# Altium project PCB_Concentrator.PrjPcb (part 1 of 3)
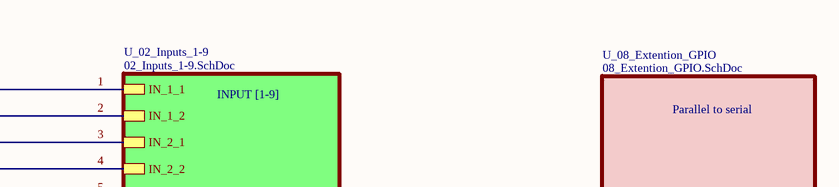
[diagram p0: 01_Main.SchDoc, top left]
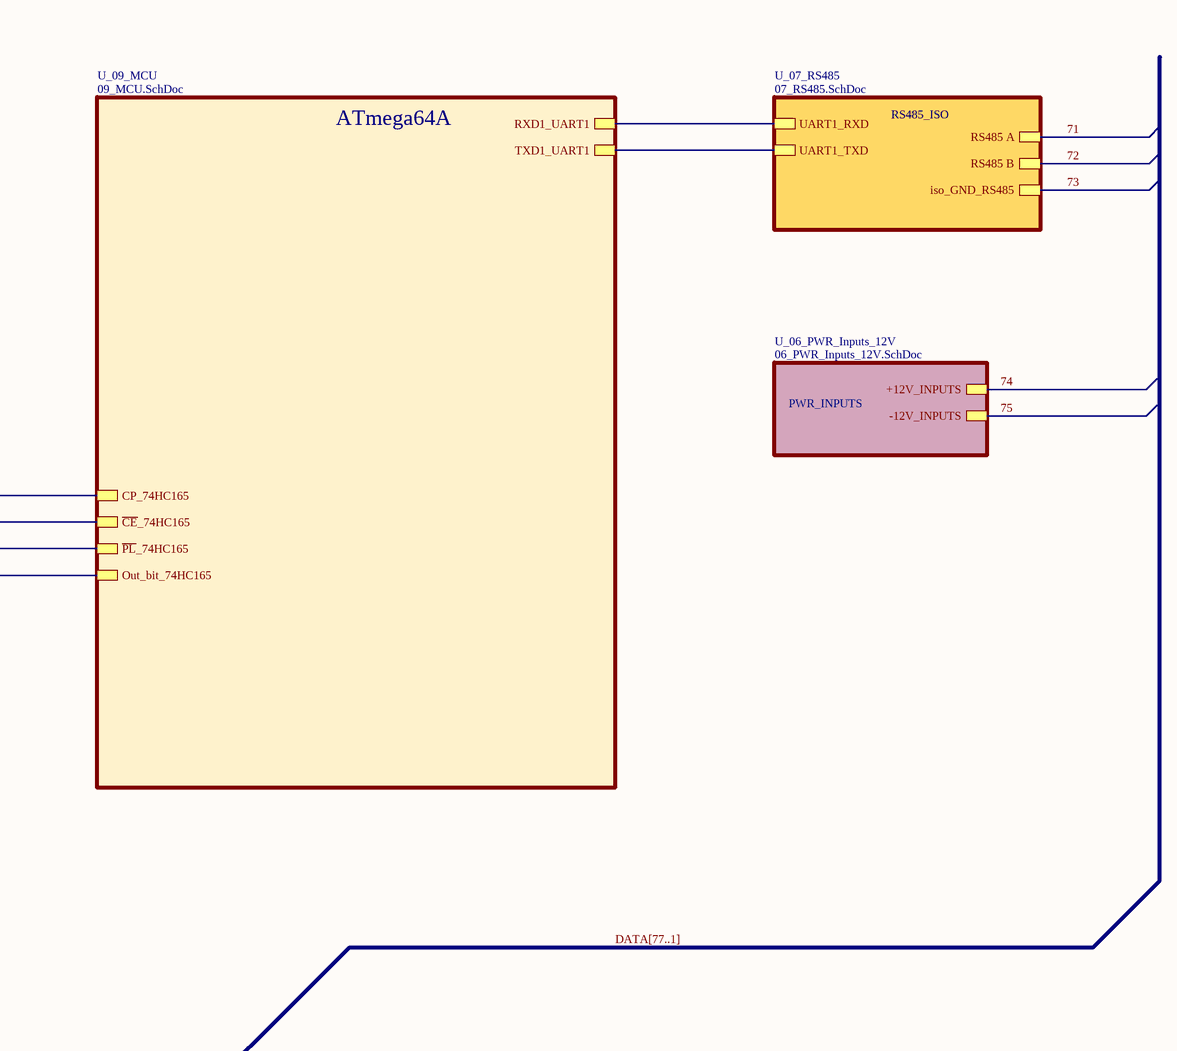
[diagram p1: 01_Main.SchDoc, top right]
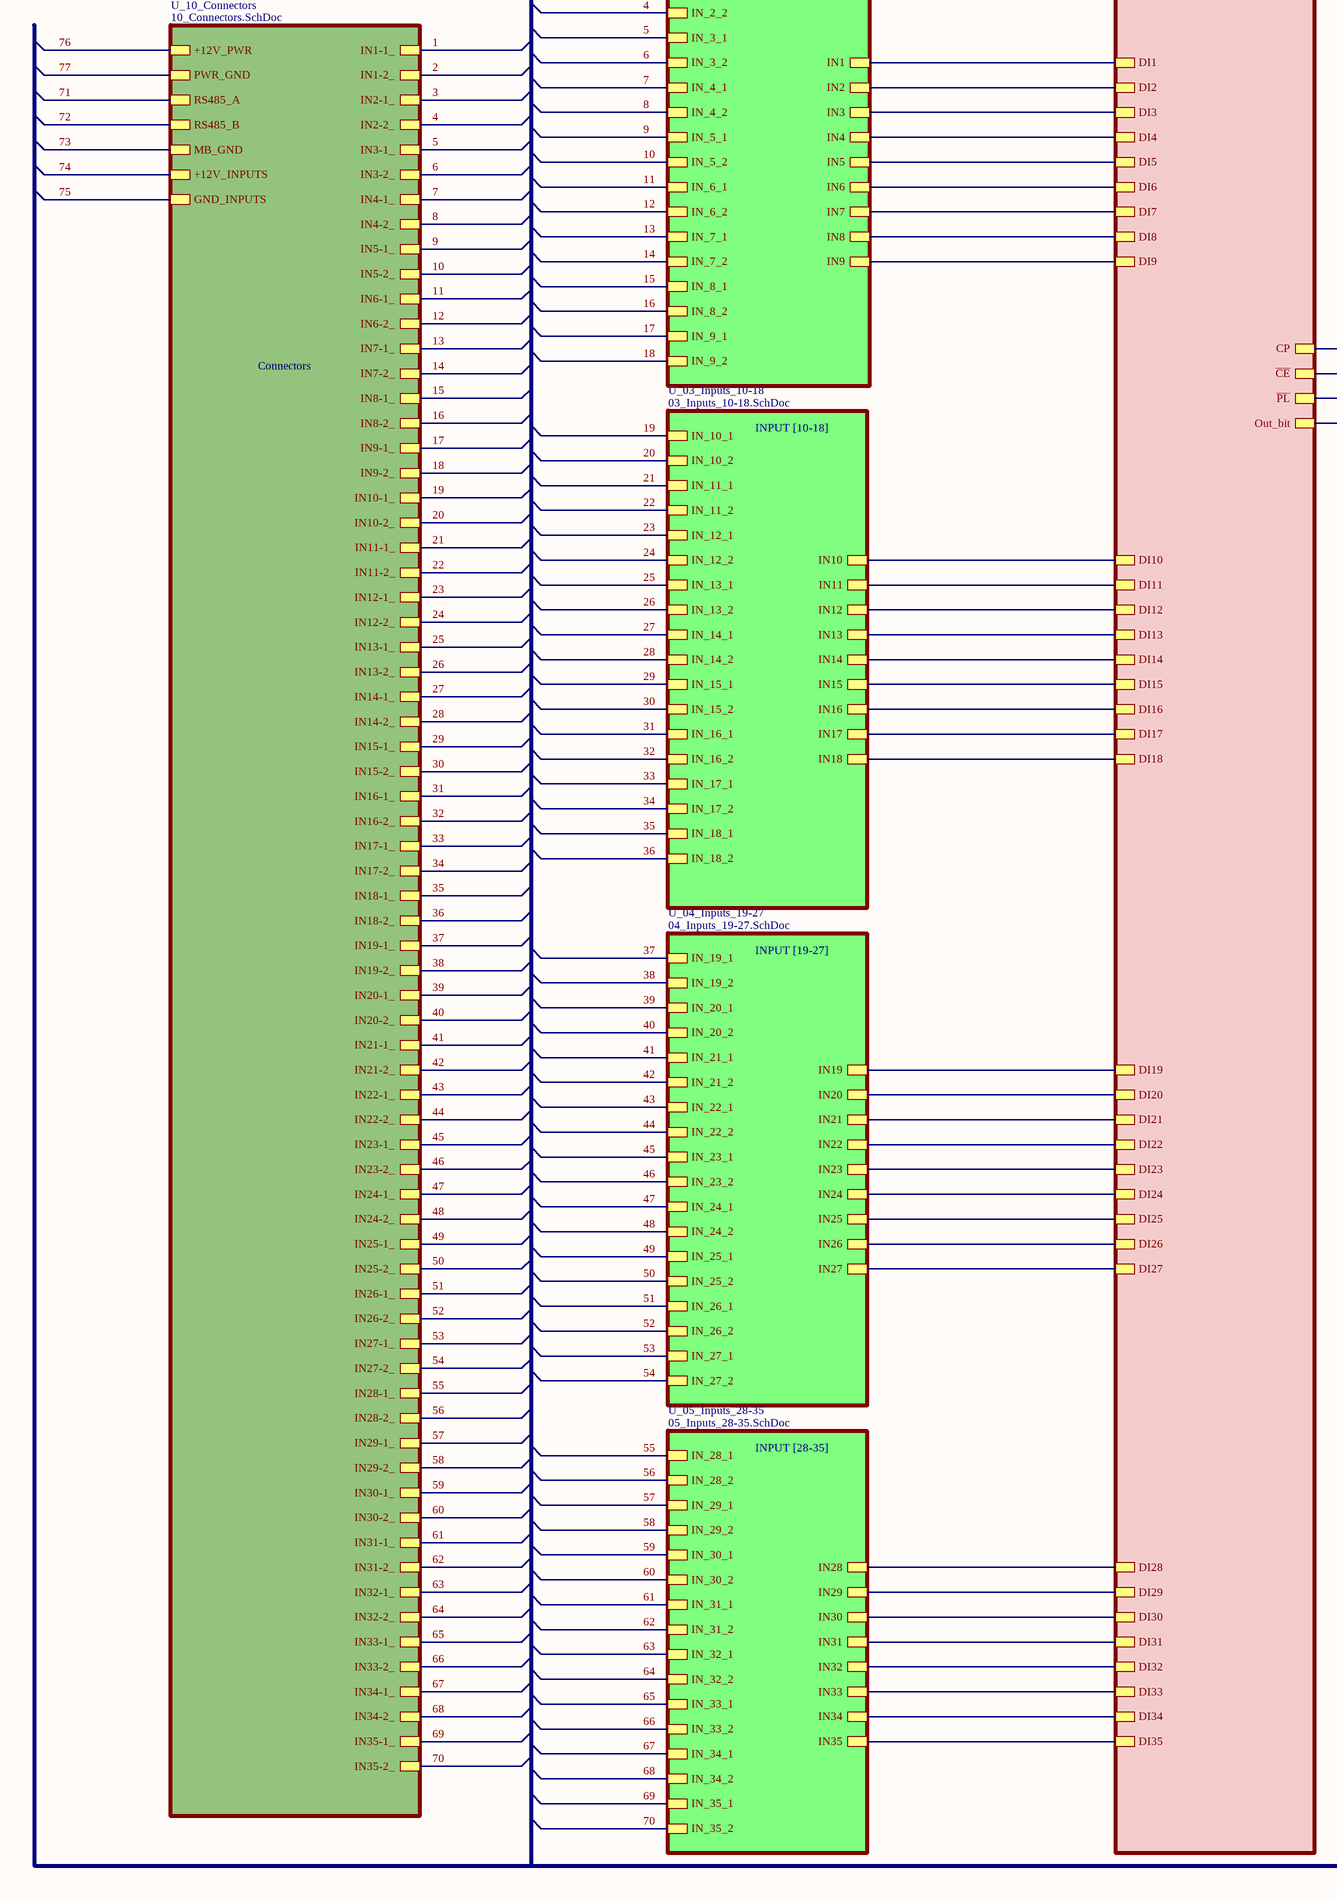
[diagram p2: 01_Main.SchDoc, bottom left]
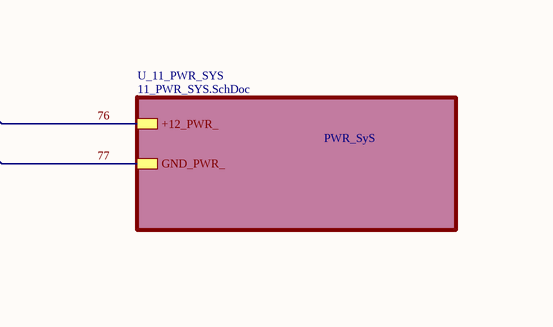
[diagram p3: 01_Main.SchDoc, bottom right]
11 sheets, 542 parts. Net scope: hierarchical (ports join the sheet entries above them; power ports are global).
Board file: pcb-4layer-1oz-1.6mm.PcbDoc
Sheets:
  01_Main.SchDoc
    U_02_Inputs_1-9 = 02_Inputs_1-9.SchDoc
    U_03_Inputs_10-18 = 03_Inputs_10-18.SchDoc
    U_04_Inputs_19-27 = 04_Inputs_19-27.SchDoc
    U_05_Inputs_28-35 = 05_Inputs_28-35.SchDoc
    U_07_RS485 = 07_RS485.SchDoc
    U_06_PWR_Inputs_12V = 06_PWR_Inputs_12V.SchDoc
    U_08_Extention_GPIO = 08_Extention_GPIO.SchDoc
    U_09_MCU = 09_MCU.SchDoc
    U_10_Connectors = 10_Connectors.SchDoc
    U_11_PWR_SYS = 11_PWR_SYS.SchDoc

## Sheet 01_Main.SchDoc: Concentrator
size 594 x 420 mm; ApprovedBy: Ульянов А.В.; CheckedBy: Ульянов А.В.; Author: Ульянов А.В.; CompanyName: voidelectrics; DrawnBy: Ульянов А.В.; Engineer: Ульянов А.В.; Organization: voidelectrics; DocumentNumber: Concentrator; SheetNumber: 1; SheetTotal: 11

### Sub-sheets
U_02_Inputs_1-9 = 02_Inputs_1-9.SchDoc: IN_1_2, IN_1_1, IN_2_2, IN_2_1, IN_3_2, IN_3_1, IN_4_2, IN_4_1, IN_5_2, IN_5_1, IN_6_2, IN_6_1, IN_7_2, IN_7_1, IN_8_2, IN_8_1, IN_9_2, IN_9_1, IN1, IN2, IN3, IN4, IN5, IN6, IN7, IN8, IN9
U_03_Inputs_10-18 = 03_Inputs_10-18.SchDoc: IN_18_2, IN_18_1, IN_10_2, IN_10_1, IN_11_2, IN_11_1, IN_12_2, IN_12_1, IN_13_2, IN_13_1, IN_14_2, IN_14_1, IN_15_2, IN_15_1, IN_16_2, IN_16_1, IN_17_2, IN_17_1, IN18, IN10, IN11, IN12, IN13, IN14, IN15, IN16, IN17
U_04_Inputs_19-27 = 04_Inputs_19-27.SchDoc: IN_19_2, IN_19_1, IN_20_2, IN_20_1, IN_21_2, IN_21_1, IN_22_2, IN_22_1, IN_23_2, IN_23_1, IN_24_2, IN_24_1, IN_25_2, IN_25_1, IN_26_2, IN_26_1, IN_27_2, IN_27_1, IN19, IN20, IN21, IN22, IN23, IN24, IN25, IN26, IN27
U_05_Inputs_28-35 = 05_Inputs_28-35.SchDoc: IN_28_2, IN_28_1, IN_29_2, IN_29_1, IN_30_2, IN_30_1, IN_31_2, IN_31_1, IN_32_2, IN_32_1, IN_33_2, IN_33_1, IN_34_2, IN_34_1, IN_35_2, IN_35_1, IN28, IN29, IN30, IN31, IN32, IN33, IN34, IN35
U_06_PWR_Inputs_12V = 06_PWR_Inputs_12V.SchDoc: +12V_INPUTS, -12V_INPUTS
U_07_RS485 = 07_RS485.SchDoc: UART1_RXD, UART1_TXD, RS485 B, RS485 A, iso_GND_RS485
U_08_Extention_GPIO = 08_Extention_GPIO.SchDoc: DI1, DI2, DI3, DI4, DI5, DI6, DI7, DI8, DI9, DI10, DI11, DI12, DI13, DI14, DI15, DI16, DI17, DI18, DI19, DI20, DI21, DI22, DI23, DI24, DI25, DI26, DI27, DI28, DI29, DI30, DI31, DI32, DI33, DI34, DI35, CP, ~{CE}, ~{PL}, Out_bit
U_09_MCU = 09_MCU.SchDoc: CP_74HC165, ~{CE}_74HC165, ~{PL}_74HC165, Out_bit_74HC165, RXD1_UART1, TXD1_UART1
U_10_Connectors = 10_Connectors.SchDoc: +12V_PWR, PWR_GND, RS485_A, RS485_B, MB_GND, +12V_INPUTS, GND_INPUTS, IN1-1_, IN1-2_, IN2-1_, IN2-2_, IN3-1_, IN3-2_, IN4-1_, IN4-2_, IN5-1_, IN5-2_, IN6-1_, IN6-2_, IN7-1_, IN7-2_, IN8-1_, IN8-2_, IN9-1_, IN9-2_, IN10-1_, IN10-2_, IN11-1_, IN11-2_, IN12-1_, IN12-2_, IN13-1_, IN13-2_, IN14-1_, IN14-2_, IN15-1_, IN15-2_, IN16-1_, IN16-2_, IN17-1_, IN17-2_, IN18-1_, IN18-2_, IN19-1_, IN19-2_, IN20-1_, IN20-2_, IN21-1_, IN21-2_, IN22-1_, IN22-2_, IN23-1_, IN23-2_, IN24-1_, IN24-2_, IN25-1_, IN25-2_, IN26-1_, IN26-2_, IN27-1_, IN27-2_, IN28-1_, IN28-2_, IN29-1_, IN29-2_, IN30-1_, IN30-2_, IN31-1_, IN31-2_, IN32-1_, IN32-2_, IN33-1_, IN33-2_, IN34-1_, IN34-2_, IN35-1_, IN35-2_
U_11_PWR_SYS = 11_PWR_SYS.SchDoc: +12_PWR_, GND_PWR_

### Nets
1: sheet U_02_Inputs_1-9/IN_1_1, sheet U_10_Connectors/IN1-1_
2: sheet U_02_Inputs_1-9/IN_1_2, sheet U_10_Connectors/IN1-2_
3: sheet U_02_Inputs_1-9/IN_2_1, sheet U_10_Connectors/IN2-1_
4: sheet U_02_Inputs_1-9/IN_2_2, sheet U_10_Connectors/IN2-2_
5: sheet U_02_Inputs_1-9/IN_3_1, sheet U_10_Connectors/IN3-1_
6: sheet U_02_Inputs_1-9/IN_3_2, sheet U_10_Connectors/IN3-2_
7: sheet U_02_Inputs_1-9/IN_4_1, sheet U_10_Connectors/IN4-1_
8: sheet U_02_Inputs_1-9/IN_4_2, sheet U_10_Connectors/IN4-2_
9: sheet U_02_Inputs_1-9/IN_5_1, sheet U_10_Connectors/IN5-1_
10: sheet U_02_Inputs_1-9/IN_5_2, sheet U_10_Connectors/IN5-2_
11: sheet U_02_Inputs_1-9/IN_6_1, sheet U_10_Connectors/IN6-1_
12: sheet U_02_Inputs_1-9/IN_6_2, sheet U_10_Connectors/IN6-2_
13: sheet U_02_Inputs_1-9/IN_7_1, sheet U_10_Connectors/IN7-1_
14: sheet U_02_Inputs_1-9/IN_7_2, sheet U_10_Connectors/IN7-2_
15: sheet U_02_Inputs_1-9/IN_8_1, sheet U_10_Connectors/IN8-1_
16: sheet U_02_Inputs_1-9/IN_8_2, sheet U_10_Connectors/IN8-2_
17: sheet U_02_Inputs_1-9/IN_9_1, sheet U_10_Connectors/IN9-1_
18: sheet U_02_Inputs_1-9/IN_9_2, sheet U_10_Connectors/IN9-2_
19: sheet U_03_Inputs_10-18/IN_10_1, sheet U_10_Connectors/IN10-1_
20: sheet U_03_Inputs_10-18/IN_10_2, sheet U_10_Connectors/IN10-2_
21: sheet U_03_Inputs_10-18/IN_11_1, sheet U_10_Connectors/IN11-1_
22: sheet U_03_Inputs_10-18/IN_11_2, sheet U_10_Connectors/IN11-2_
23: sheet U_03_Inputs_10-18/IN_12_1, sheet U_10_Connectors/IN12-1_
24: sheet U_03_Inputs_10-18/IN_12_2, sheet U_10_Connectors/IN12-2_
25: sheet U_03_Inputs_10-18/IN_13_1, sheet U_10_Connectors/IN13-1_
26: sheet U_03_Inputs_10-18/IN_13_2, sheet U_10_Connectors/IN13-2_
27: sheet U_03_Inputs_10-18/IN_14_1, sheet U_10_Connectors/IN14-1_
28: sheet U_03_Inputs_10-18/IN_14_2, sheet U_10_Connectors/IN14-2_
29: sheet U_03_Inputs_10-18/IN_15_1, sheet U_10_Connectors/IN15-1_
30: sheet U_03_Inputs_10-18/IN_15_2, sheet U_10_Connectors/IN15-2_
31: sheet U_03_Inputs_10-18/IN_16_1, sheet U_10_Connectors/IN16-1_
32: sheet U_03_Inputs_10-18/IN_16_2, sheet U_10_Connectors/IN16-2_
33: sheet U_03_Inputs_10-18/IN_17_1, sheet U_10_Connectors/IN17-1_
34: sheet U_03_Inputs_10-18/IN_17_2, sheet U_10_Connectors/IN17-2_
35: sheet U_03_Inputs_10-18/IN_18_1, sheet U_10_Connectors/IN18-1_
36: sheet U_03_Inputs_10-18/IN_18_2, sheet U_10_Connectors/IN18-2_
37: sheet U_04_Inputs_19-27/IN_19_1, sheet U_10_Connectors/IN19-1_
38: sheet U_04_Inputs_19-27/IN_19_2, sheet U_10_Connectors/IN19-2_
39: sheet U_04_Inputs_19-27/IN_20_1, sheet U_10_Connectors/IN20-1_
40: sheet U_04_Inputs_19-27/IN_20_2, sheet U_10_Connectors/IN20-2_
41: sheet U_04_Inputs_19-27/IN_21_1, sheet U_10_Connectors/IN21-1_
42: sheet U_04_Inputs_19-27/IN_21_2, sheet U_10_Connectors/IN21-2_
43: sheet U_04_Inputs_19-27/IN_22_1, sheet U_10_Connectors/IN22-1_
44: sheet U_04_Inputs_19-27/IN_22_2, sheet U_10_Connectors/IN22-2_
45: sheet U_04_Inputs_19-27/IN_23_1, sheet U_10_Connectors/IN23-1_
46: sheet U_04_Inputs_19-27/IN_23_2, sheet U_10_Connectors/IN23-2_
47: sheet U_04_Inputs_19-27/IN_24_1, sheet U_10_Connectors/IN24-1_
48: sheet U_04_Inputs_19-27/IN_24_2, sheet U_10_Connectors/IN24-2_
49: sheet U_04_Inputs_19-27/IN_25_1, sheet U_10_Connectors/IN25-1_
50: sheet U_04_Inputs_19-27/IN_25_2, sheet U_10_Connectors/IN25-2_
51: sheet U_04_Inputs_19-27/IN_26_1, sheet U_10_Connectors/IN26-1_
52: sheet U_04_Inputs_19-27/IN_26_2, sheet U_10_Connectors/IN26-2_
53: sheet U_04_Inputs_19-27/IN_27_1, sheet U_10_Connectors/IN27-1_
54: sheet U_04_Inputs_19-27/IN_27_2, sheet U_10_Connectors/IN27-2_
55: sheet U_05_Inputs_28-35/IN_28_1, sheet U_10_Connectors/IN28-1_
56: sheet U_05_Inputs_28-35/IN_28_2, sheet U_10_Connectors/IN28-2_
57: sheet U_05_Inputs_28-35/IN_29_1, sheet U_10_Connectors/IN29-1_
58: sheet U_05_Inputs_28-35/IN_29_2, sheet U_10_Connectors/IN29-2_
59: sheet U_05_Inputs_28-35/IN_30_1, sheet U_10_Connectors/IN30-1_
60: sheet U_05_Inputs_28-35/IN_30_2, sheet U_10_Connectors/IN30-2_
61: sheet U_05_Inputs_28-35/IN_31_1, sheet U_10_Connectors/IN31-1_
62: sheet U_05_Inputs_28-35/IN_31_2, sheet U_10_Connectors/IN31-2_
63: sheet U_05_Inputs_28-35/IN_32_1, sheet U_10_Connectors/IN32-1_
64: sheet U_05_Inputs_28-35/IN_32_2, sheet U_10_Connectors/IN32-2_
65: sheet U_05_Inputs_28-35/IN_33_1, sheet U_10_Connectors/IN33-1_
66: sheet U_05_Inputs_28-35/IN_33_2, sheet U_10_Connectors/IN33-2_
67: sheet U_05_Inputs_28-35/IN_34_1, sheet U_10_Connectors/IN34-1_
68: sheet U_05_Inputs_28-35/IN_34_2, sheet U_10_Connectors/IN34-2_
69: sheet U_05_Inputs_28-35/IN_35_1, sheet U_10_Connectors/IN35-1_
70: sheet U_05_Inputs_28-35/IN_35_2, sheet U_10_Connectors/IN35-2_
71: sheet U_07_RS485/RS485 A, sheet U_10_Connectors/RS485_A
72: sheet U_07_RS485/RS485 B, sheet U_10_Connectors/RS485_B
73: sheet U_07_RS485/iso_GND_RS485, sheet U_10_Connectors/MB_GND
74: sheet U_06_PWR_Inputs_12V/+12V_INPUTS, sheet U_10_Connectors/+12V_INPUTS
75: sheet U_06_PWR_Inputs_12V/-12V_INPUTS, sheet U_10_Connectors/GND_INPUTS
76: sheet U_10_Connectors/+12V_PWR, sheet U_11_PWR_SYS/+12_PWR_
77: sheet U_10_Connectors/PWR_GND, sheet U_11_PWR_SYS/GND_PWR_
RXD: sheet U_07_RS485/UART1_RXD, sheet U_09_MCU/RXD1_UART1
TXD: sheet U_07_RS485/UART1_TXD, sheet U_09_MCU/TXD1_UART1
NetR15_2: sheet U_05_Inputs_28-35/IN31, sheet U_08_Extention_GPIO/DI31
NetR16_2: sheet U_05_Inputs_28-35/IN28, sheet U_08_Extention_GPIO/DI28
NetR20_2: sheet U_05_Inputs_28-35/IN34, sheet U_08_Extention_GPIO/DI34
NetR31_2: sheet U_05_Inputs_28-35/IN29, sheet U_08_Extention_GPIO/DI29
NetR32_2: sheet U_05_Inputs_28-35/IN32, sheet U_08_Extention_GPIO/DI32
NetR40_2: sheet U_05_Inputs_28-35/IN35, sheet U_08_Extention_GPIO/DI35
NetR47_2: sheet U_05_Inputs_28-35/IN33, sheet U_08_Extention_GPIO/DI33
NetR48_2: sheet U_05_Inputs_28-35/IN30, sheet U_08_Extention_GPIO/DI30
NetR64_2: sheet U_02_Inputs_1-9/IN1, sheet U_08_Extention_GPIO/DI1
NetR65_2: sheet U_02_Inputs_1-9/IN4, sheet U_08_Extention_GPIO/DI4
NetR66_2: sheet U_02_Inputs_1-9/IN7, sheet U_08_Extention_GPIO/DI7
NetR82_2: sheet U_02_Inputs_1-9/IN2, sheet U_08_Extention_GPIO/DI2
NetR83_2: sheet U_02_Inputs_1-9/IN5, sheet U_08_Extention_GPIO/DI5
NetR84_2: sheet U_02_Inputs_1-9/IN8, sheet U_08_Extention_GPIO/DI8
NetR100_2: sheet U_02_Inputs_1-9/IN6, sheet U_08_Extention_GPIO/DI6
NetR101_2: sheet U_02_Inputs_1-9/IN9, sheet U_08_Extention_GPIO/DI9
NetR102_2: sheet U_02_Inputs_1-9/IN3, sheet U_08_Extention_GPIO/DI3
NetR118_2: sheet U_03_Inputs_10-18/IN18, sheet U_08_Extention_GPIO/DI18
NetR119_2: sheet U_03_Inputs_10-18/IN12, sheet U_08_Extention_GPIO/DI12
NetR120_2: sheet U_03_Inputs_10-18/IN15, sheet U_08_Extention_GPIO/DI15
NetR136_2: sheet U_03_Inputs_10-18/IN10, sheet U_08_Extention_GPIO/DI10
NetR137_2: sheet U_03_Inputs_10-18/IN13, sheet U_08_Extention_GPIO/DI13
NetR138_2: sheet U_03_Inputs_10-18/IN16, sheet U_08_Extention_GPIO/DI16
NetR154_2: sheet U_03_Inputs_10-18/IN11, sheet U_08_Extention_GPIO/DI11
NetR155_2: sheet U_03_Inputs_10-18/IN14, sheet U_08_Extention_GPIO/DI14
NetR156_2: sheet U_03_Inputs_10-18/IN17, sheet U_08_Extention_GPIO/DI17
NetR172_2: sheet U_04_Inputs_19-27/IN22, sheet U_08_Extention_GPIO/DI22
NetR173_2: sheet U_04_Inputs_19-27/IN19, sheet U_08_Extention_GPIO/DI19
NetR174_2: sheet U_04_Inputs_19-27/IN25, sheet U_08_Extention_GPIO/DI25
NetR190_2: sheet U_04_Inputs_19-27/IN20, sheet U_08_Extention_GPIO/DI20
NetR191_2: sheet U_04_Inputs_19-27/IN23, sheet U_08_Extention_GPIO/DI23
NetR192_2: sheet U_04_Inputs_19-27/IN26, sheet U_08_Extention_GPIO/DI26
NetR208_2: sheet U_04_Inputs_19-27/IN21, sheet U_08_Extention_GPIO/DI21
NetR209_2: sheet U_04_Inputs_19-27/IN24, sheet U_08_Extention_GPIO/DI24
NetR210_2: sheet U_04_Inputs_19-27/IN27, sheet U_08_Extention_GPIO/DI27
NetR220_1: sheet U_08_Extention_GPIO/Out_bit, sheet U_09_MCU/Out_bit_74HC165
NetR221_1: sheet U_08_Extention_GPIO/CP, sheet U_09_MCU/CP_74HC165
NetR222_1: sheet U_08_Extention_GPIO/~{PL}, sheet U_09_MCU/~{PL}_74HC165
NetR228_1: sheet U_08_Extention_GPIO/~{CE}, sheet U_09_MCU/~{CE}_74HC165

### Buses and harness runs
bus DATA[77..1]

### Notes on the sheet
- INPUT [1-9]
- Parallel to serial
- ATmega64A
- RS485_ISO
- PWR_INPUTS
- Connectors
- INPUT [10-18]
- INPUT [19-27]
- PWR_SyS
- INPUT [28-35]
- Перв. примен.
- Справ. №
- Подп. и дата
- Инв. № дубл.
- Взам. инв. №
- Разраб.
- Изм.
- Лист
- № докум.
- Подп.
- Дата
- Лит.
- Масса
- Масштаб
- Пров.
- Т.контр.
- Листов
- Инв. № подл.
- Утв.
- Н.контр.
- 2.106-A2
- Копировал
- Формат А2

## Sheet 02_Inputs_1-9.SchDoc
size 594 x 420 mm; DocumentNumber: Входы сухой контакт; SheetNumber: 2; SheetTotal: 7
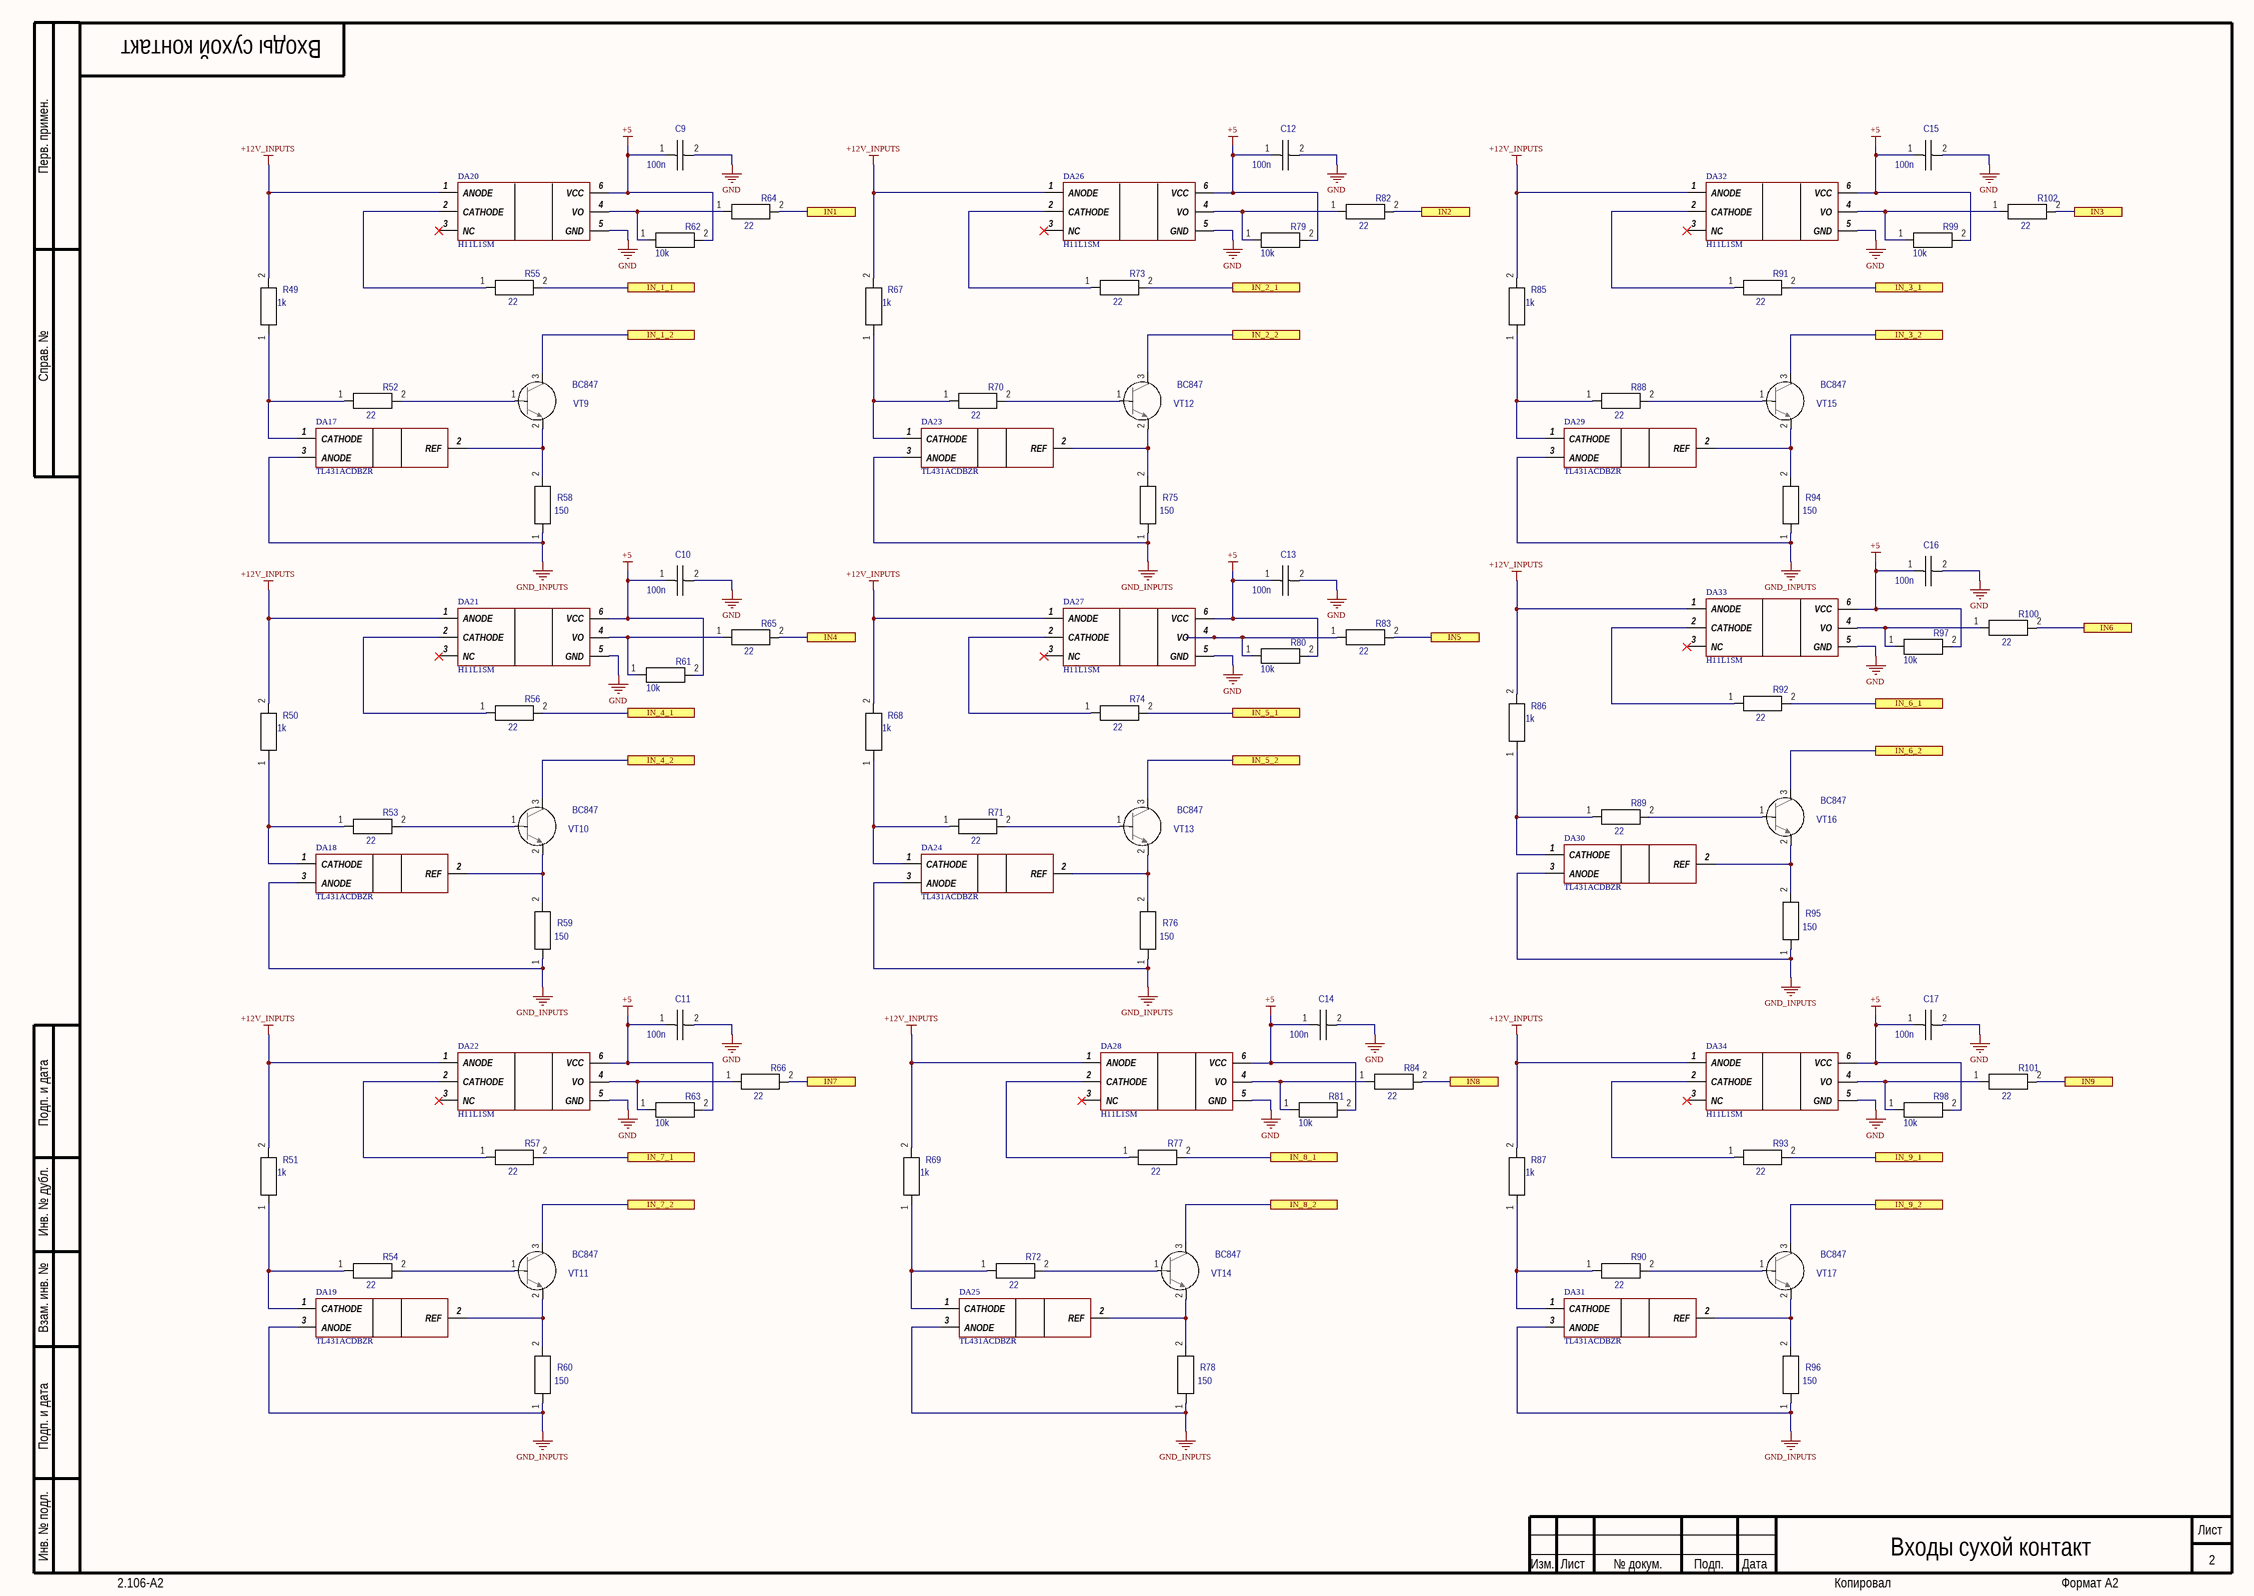
[diagram p4: 02_Inputs_1-9.SchDoc]

### Parts
C9  value 100n  [C0603]  (hidden comment: C0603)
C10  value 100n  [C0603]  (hidden comment: C0603)
C11  value 100n  [C0603]  (hidden comment: C0603)
C12  value 100n  [C0603]  (hidden comment: C0603)
C13  value 100n  [C0603]  (hidden comment: C0603)
C14  value 100n  [C0603]  (hidden comment: C0603)
C15  value 100n  [C0603]  (hidden comment: C0603)
C16  value 100n  [C0603]  (hidden comment: C0603)
C17  value 100n  [C0603]  (hidden comment: C0603)
DA17  TL431ACDBZR  [SOT95P237X112-3N]
DA18  TL431ACDBZR  [SOT95P237X112-3N]
DA19  TL431ACDBZR  [SOT95P237X112-3N]
DA20  H11L1SM  [SOP254P1030X460-6N]
DA21  H11L1SM  [SOP254P1030X460-6N]
DA22  H11L1SM  [SOP254P1030X460-6N]
DA23  TL431ACDBZR  [SOT95P237X112-3N]
DA24  TL431ACDBZR  [SOT95P237X112-3N]
DA25  TL431ACDBZR  [SOT95P237X112-3N]
DA26  H11L1SM  [SOP254P1030X460-6N]
DA27  H11L1SM  [SOP254P1030X460-6N]
DA28  H11L1SM  [SOP254P1030X460-6N]
DA29  TL431ACDBZR  [SOT95P237X112-3N]
DA30  TL431ACDBZR  [SOT95P237X112-3N]
DA31  TL431ACDBZR  [SOT95P237X112-3N]
DA32  H11L1SM  [SOP254P1030X460-6N]
DA33  H11L1SM  [SOP254P1030X460-6N]
DA34  H11L1SM  [SOP254P1030X460-6N]
R49  value 1k  [RESC1608N]  (hidden comment: R0603)
R50  value 1k  [RESC1608N]  (hidden comment: R0603)
R51  value 1k  [RESC1608N]  (hidden comment: R0603)
R52  value 22  [RESC1608N]  (hidden comment: R0603)
R53  value 22  [RESC1608N]  (hidden comment: R0603)
R54  value 22  [RESC1608N]  (hidden comment: R0603)
R55  value 22  [RESC1608N]  (hidden comment: R0603)
R56  value 22  [RESC1608N]  (hidden comment: R0603)
R57  value 22  [RESC1608N]  (hidden comment: R0603)
R58  value 150  [RESC1608N]  (hidden comment: R0603)
R59  value 150  [RESC1608N]  (hidden comment: R0603)
R60  value 150  [RESC1608N]  (hidden comment: R0603)
R61  value 10k  [RESC1608N]  (hidden comment: R0603)
R62  value 10k  [RESC1608N]  (hidden comment: R0603)
R63  value 10k  [RESC1608N]  (hidden comment: R0603)
R64  value 22  [RESC1608N]  (hidden comment: R0603)
R65  value 22  [RESC1608N]  (hidden comment: R0603)
R66  value 22  [RESC1608N]  (hidden comment: R0603)
R67  value 1k  [RESC1608N]  (hidden comment: R0603)
R68  value 1k  [RESC1608N]  (hidden comment: R0603)
R69  value 1k  [RESC1608N]  (hidden comment: R0603)
R70  value 22  [RESC1608N]  (hidden comment: R0603)
R71  value 22  [RESC1608N]  (hidden comment: R0603)
R72  value 22  [RESC1608N]  (hidden comment: R0603)
R73  value 22  [RESC1608N]  (hidden comment: R0603)
R74  value 22  [RESC1608N]  (hidden comment: R0603)
R75  value 150  [RESC1608N]  (hidden comment: R0603)
R76  value 150  [RESC1608N]  (hidden comment: R0603)
R77  value 22  [RESC1608N]  (hidden comment: R0603)
R78  value 150  [RESC1608N]  (hidden comment: R0603)
R79  value 10k  [RESC1608N]  (hidden comment: R0603)
R80  value 10k  [RESC1608N]  (hidden comment: R0603)
R81  value 10k  [RESC1608N]  (hidden comment: R0603)
R82  value 22  [RESC1608N]  (hidden comment: R0603)
R83  value 22  [RESC1608N]  (hidden comment: R0603)
R84  value 22  [RESC1608N]  (hidden comment: R0603)
R85  value 1k  [RESC1608N]  (hidden comment: R0603)
R86  value 1k  [RESC1608N]  (hidden comment: R0603)
R87  value 1k  [RESC1608N]  (hidden comment: R0603)
R88  value 22  [RESC1608N]  (hidden comment: R0603)
R89  value 22  [RESC1608N]  (hidden comment: R0603)
R90  value 22  [RESC1608N]  (hidden comment: R0603)
R91  value 22  [RESC1608N]  (hidden comment: R0603)
R92  value 22  [RESC1608N]  (hidden comment: R0603)
R93  value 22  [RESC1608N]  (hidden comment: R0603)
R94  value 150  [RESC1608N]  (hidden comment: R0603)
R95  value 150  [RESC1608N]  (hidden comment: R0603)
R96  value 150  [RESC1608N]  (hidden comment: R0603)
R97  value 10k  [RESC1608N]  (hidden comment: R0603)
R98  value 10k  [RESC1608N]  (hidden comment: R0603)
R99  value 10k  [RESC1608N]  (hidden comment: R0603)
R100  value 22  [RESC1608N]  (hidden comment: R0603)
R101  value 22  [RESC1608N]  (hidden comment: R0603)
R102  value 22  [RESC1608N]  (hidden comment: R0603)
VT9  BC847  [SOT23-3N]
VT10  BC847  [SOT23-3N]
VT11  BC847  [SOT23-3N]
VT12  BC847  [SOT23-3N]
VT13  BC847  [SOT23-3N]
VT14  BC847  [SOT23-3N]
VT15  BC847  [SOT23-3N]
VT16  BC847  [SOT23-3N]
VT17  BC847  [SOT23-3N]

### Ports
IN1, IN2, IN3, IN4, IN5, IN6, IN7, IN8, IN9, IN_1_1, IN_1_2, IN_2_1, IN_2_2, IN_3_1, IN_3_2, IN_4_1, IN_4_2, IN_5_1, IN_5_2, IN_6_1, IN_6_2, IN_7_1, IN_7_2, IN_8_1, IN_8_2, IN_9_1, IN_9_2

### Nets
+5: C9.1 C10.1 C11.1 C12.1 C13.1 C14.1 C15.1 C16.1 C17.1 DA20.6(VCC) DA21.6(VCC) DA22.6(VCC) DA26.6(VCC) DA27.6(VCC) DA28.6(VCC) DA32.6(VCC) DA33.6(VCC) DA34.6(VCC) R61.2 R62.2 R63.2 R79.2 R80.2 R81.2 R97.2 R98.2 R99.2
+12V_INPUTS: DA20.1(ANODE) DA21.1(ANODE) DA22.1(ANODE) DA26.1(ANODE) DA27.1(ANODE) DA28.1(ANODE) DA32.1(ANODE) DA33.1(ANODE) DA34.1(ANODE) R49.2 R50.2 R51.2 R67.2 R68.2 R69.2 R85.2 R86.2 R87.2
GND: C9.2 C10.2 C11.2 C12.2 C13.2 C14.2 C15.2 C16.2 C17.2 DA20.5(GND) DA21.5(GND) DA22.5(GND) DA26.5(GND) DA27.5(GND) DA28.5(GND) DA32.5(GND) DA33.5(GND) DA34.5(GND)
GND_INPUTS: DA17.3(ANODE) DA18.3(ANODE) DA19.3(ANODE) DA23.3(ANODE) DA24.3(ANODE) DA25.3(ANODE) DA29.3(ANODE) DA30.3(ANODE) DA31.3(ANODE) R58.1 R59.1 R60.1 R75.1 R76.1 R78.1 R94.1 R95.1 R96.1
1: R55.2 ; port IN_1_1
2: VT9.3 ; port IN_1_2
3: R73.2 ; port IN_2_1
4: VT12.3 ; port IN_2_2
5: R91.2 ; port IN_3_1
6: VT15.3 ; port IN_3_2
7: R56.2 ; port IN_4_1
8: VT10.3 ; port IN_4_2
9: R74.2 ; port IN_5_1
10: VT13.3 ; port IN_5_2
11: R92.2 ; port IN_6_1
12: VT16.3 ; port IN_6_2
13: R57.2 ; port IN_7_1
14: VT11.3 ; port IN_7_2
15: R77.2 ; port IN_8_1
16: VT14.3 ; port IN_8_2
17: R93.2 ; port IN_9_1
18: VT17.3 ; port IN_9_2
NetDA17_1: DA17.1(CATHODE) R49.1 R52.1
NetDA17_2: DA17.2(REF) R58.2 VT9.2
NetDA18_1: DA18.1(CATHODE) R50.1 R53.1
NetDA18_2: DA18.2(REF) R59.2 VT10.2
NetDA19_1: DA19.1(CATHODE) R51.1 R54.1
NetDA19_2: DA19.2(REF) R60.2 VT11.2
NetDA20_2: DA20.2(CATHODE) R55.1
NetDA20_4: DA20.4(VO) R62.1 R64.1
NetDA21_2: DA21.2(CATHODE) R56.1
NetDA21_4: DA21.4(VO) R61.1 R65.1
NetDA22_2: DA22.2(CATHODE) R57.1
NetDA22_4: DA22.4(VO) R63.1 R66.1
NetDA23_1: DA23.1(CATHODE) R67.1 R70.1
NetDA23_2: DA23.2(REF) R75.2 VT12.2
NetDA24_1: DA24.1(CATHODE) R68.1 R71.1
NetDA24_2: DA24.2(REF) R76.2 VT13.2
NetDA25_1: DA25.1(CATHODE) R69.1 R72.1
NetDA25_2: DA25.2(REF) R78.2 VT14.2
NetDA26_2: DA26.2(CATHODE) R73.1
NetDA26_4: DA26.4(VO) R79.1 R82.1
NetDA27_2: DA27.2(CATHODE) R74.1
NetDA27_4: DA27.4(VO) R80.1 R83.1
NetDA28_2: DA28.2(CATHODE) R77.1
NetDA28_4: DA28.4(VO) R81.1 R84.1
NetDA29_1: DA29.1(CATHODE) R85.1 R88.1
NetDA29_2: DA29.2(REF) R94.2 VT15.2
NetDA30_1: DA30.1(CATHODE) R86.1 R89.1
NetDA30_2: DA30.2(REF) R95.2 VT16.2
NetDA31_1: DA31.1(CATHODE) R87.1 R90.1
NetDA31_2: DA31.2(REF) R96.2 VT17.2
NetDA32_2: DA32.2(CATHODE) R91.1
NetDA32_4: DA32.4(VO) R99.1 R102.1
NetDA33_2: DA33.2(CATHODE) R92.1
NetDA33_4: DA33.4(VO) R97.1 R100.1
NetDA34_2: DA34.2(CATHODE) R93.1
NetDA34_4: DA34.4(VO) R98.1 R101.1
NetR52_2: R52.2 VT9.1
NetR53_2: R53.2 VT10.1
NetR54_2: R54.2 VT11.1
NetR64_2: R64.2 ; port IN1
NetR65_2: R65.2 ; port IN4
NetR66_2: R66.2 ; port IN7
NetR70_2: R70.2 VT12.1
NetR71_2: R71.2 VT13.1
NetR72_2: R72.2 VT14.1
NetR82_2: R82.2 ; port IN2
NetR83_2: R83.2 ; port IN5
NetR84_2: R84.2 ; port IN8
NetR88_2: R88.2 VT15.1
NetR89_2: R89.2 VT16.1
NetR90_2: R90.2 VT17.1
NetR100_2: R100.2 ; port IN6
NetR101_2: R101.2 ; port IN9
NetR102_2: R102.2 ; port IN3

Not connected (* = marked no-connect by the designer): DA20 3(NC)*; DA21 3(NC)*; DA22 3(NC)*; DA26 3(NC)*; DA27 3(NC)*; DA28 3(NC)*; DA32 3(NC)*; DA33 3(NC)*; DA34 3(NC)*

### Notes on the sheet
- Перв. примен.
- Справ. №
- Подп. и дата
- Инв. № дубл.
- Взам. инв. №
- Инв. № подл.
- Изм.
- Лист
- № докум.
- Подп.
- Дата
- 2.106-A2
- Копировал
- Формат А2

### Library data of the parts
C9-C17 = GRM188R71C104KA01D: Manufacturer: Murata Manufacturing; Код: 22; ID: Конденсатор; Power/Voltage: 16V; Tolerance: ±10%; TKE: X7R; iii: Конденсатор GRM188R71C104KA01D 100n 16V ±10% C0603 X7R  Murata Manufacturing; Comments: C0603; Part Number: GRM188R71C104KA01D; Height: 0.9; Package: C0603; TemperatureMin: -55; TemperatureMax: 125
DA17-DA19 DA23-DA25 DA29-DA31 = TL431ACDBZR: Integrated Circuit; Manufacturer_Name: Texas Instruments; Datasheet Link: https://datasheet.datasheetarchive.com/originals/distributors/SFDatasheet-6/sf-000131849.pdf; Manufacturer_Part_Number: TL431ACDBZR; Mouser Part Number: 595-TL431ACDBZR; Mouser Price/Stock: https://www.mouser.co.uk/ProductDetail/Texas-Instruments/TL431ACDBZR?qs=odmYgEirbwzMcBuFx%2Fo8hQ%3D%3D; Arrow Part Number: TL431ACDBZR; Arrow Price/Stock: https://www.arrow.com/en/products/tl431acdbzr/texas-instruments?region=nac; PartNumber: TL431ACDBZR
DA20-DA22 DA26-DA28 DA32-DA34 = H11L1SM: Integrated Circuit; Manufacturer_Name: Iso Com; Datasheet Link: http://isocom.com/wp-content/uploads/2017/09/DD93224-H11L1_H11L1V-110817.pdf; Height: 4.6mm; Manufacturer_Part_Number: H11L1SM; PartNumber: H11L1SM
R49-R51 R67-R69 R85-R87 = RC0603FK-071KL: Manufacturer: Тайвань; Код: 31; ID: Резистор; Power/Voltage: 0.063W/50V; Tolerance: ±1%; iii: Резистор RC0603FK-071KL 1k 0.063W/50V ±1% R0603  Тайвань; Comments: R0603; Part Number: RC0603FK-071KL; Package: R0603; TemperatureMin: -55; TemperatureMax: 155
R52-R57 R64-R66 R70-R74 R77 R82-R84 R88-R93 R100-R102 = RC0603FK-0722RL: Manufacturer: Тайвань; Код: 11; ID: Резистор; Power/Voltage: 0.063W/50V; Tolerance: ±1%; iii: Резистор RC0603FK-0722RL 22 0.063W/50V ±1% R0603  Тайвань; Comments: R0603; Part Number: RC0603FK-0722RL; Package: R0603; TemperatureMin: -55; TemperatureMax: 155
R58-R60 R75 R76 R78 R94-R96 = RC0603FK-07150RL: Manufacturer: Тайвань; Код: 17; ID: Резистор; Power/Voltage: 0.063W/50V; Tolerance: ±1%; iii: Резистор RC0603FK-07150RL 150 0.063W/50V ±1% R0603  Тайвань; Comments: R0603; Part Number: RC0603FK-07150RL; Package: R0603; TemperatureMin: -55; TemperatureMax: 155
R61-R63 R79-R81 R97-R99 = RC0603FK-0710KL: Part Number: RC0603FR-0710KL; Manufacturer: Тайвань; Код: 26; ID: Резистор; Power/Voltage: 0.063W/50V; Tolerance: ±1%; iii: Резистор RC0603FK-0710KL 10k 0.063W/50V ±1% R0603  Тайвань; Comments: R0603; Package: R0603; TemperatureMin: -55; TemperatureMax: 155
VT9-VT17 = BC847: Manufacturer: NXP Semiconductor; Код: 2; ID: Транзистор; Value: 0.1A; Power/Voltage: 45V; iii: Транзистор BC847 0.1A 45V  sot23  NXP Semiconductor; Com: BC847; Part Number: BC847; Package: sot23

## Sheet 03_Inputs_10-18.SchDoc
size 594 x 420 mm; DocumentNumber: Входы сухой контакт; SheetNumber: 3; SheetTotal: 6
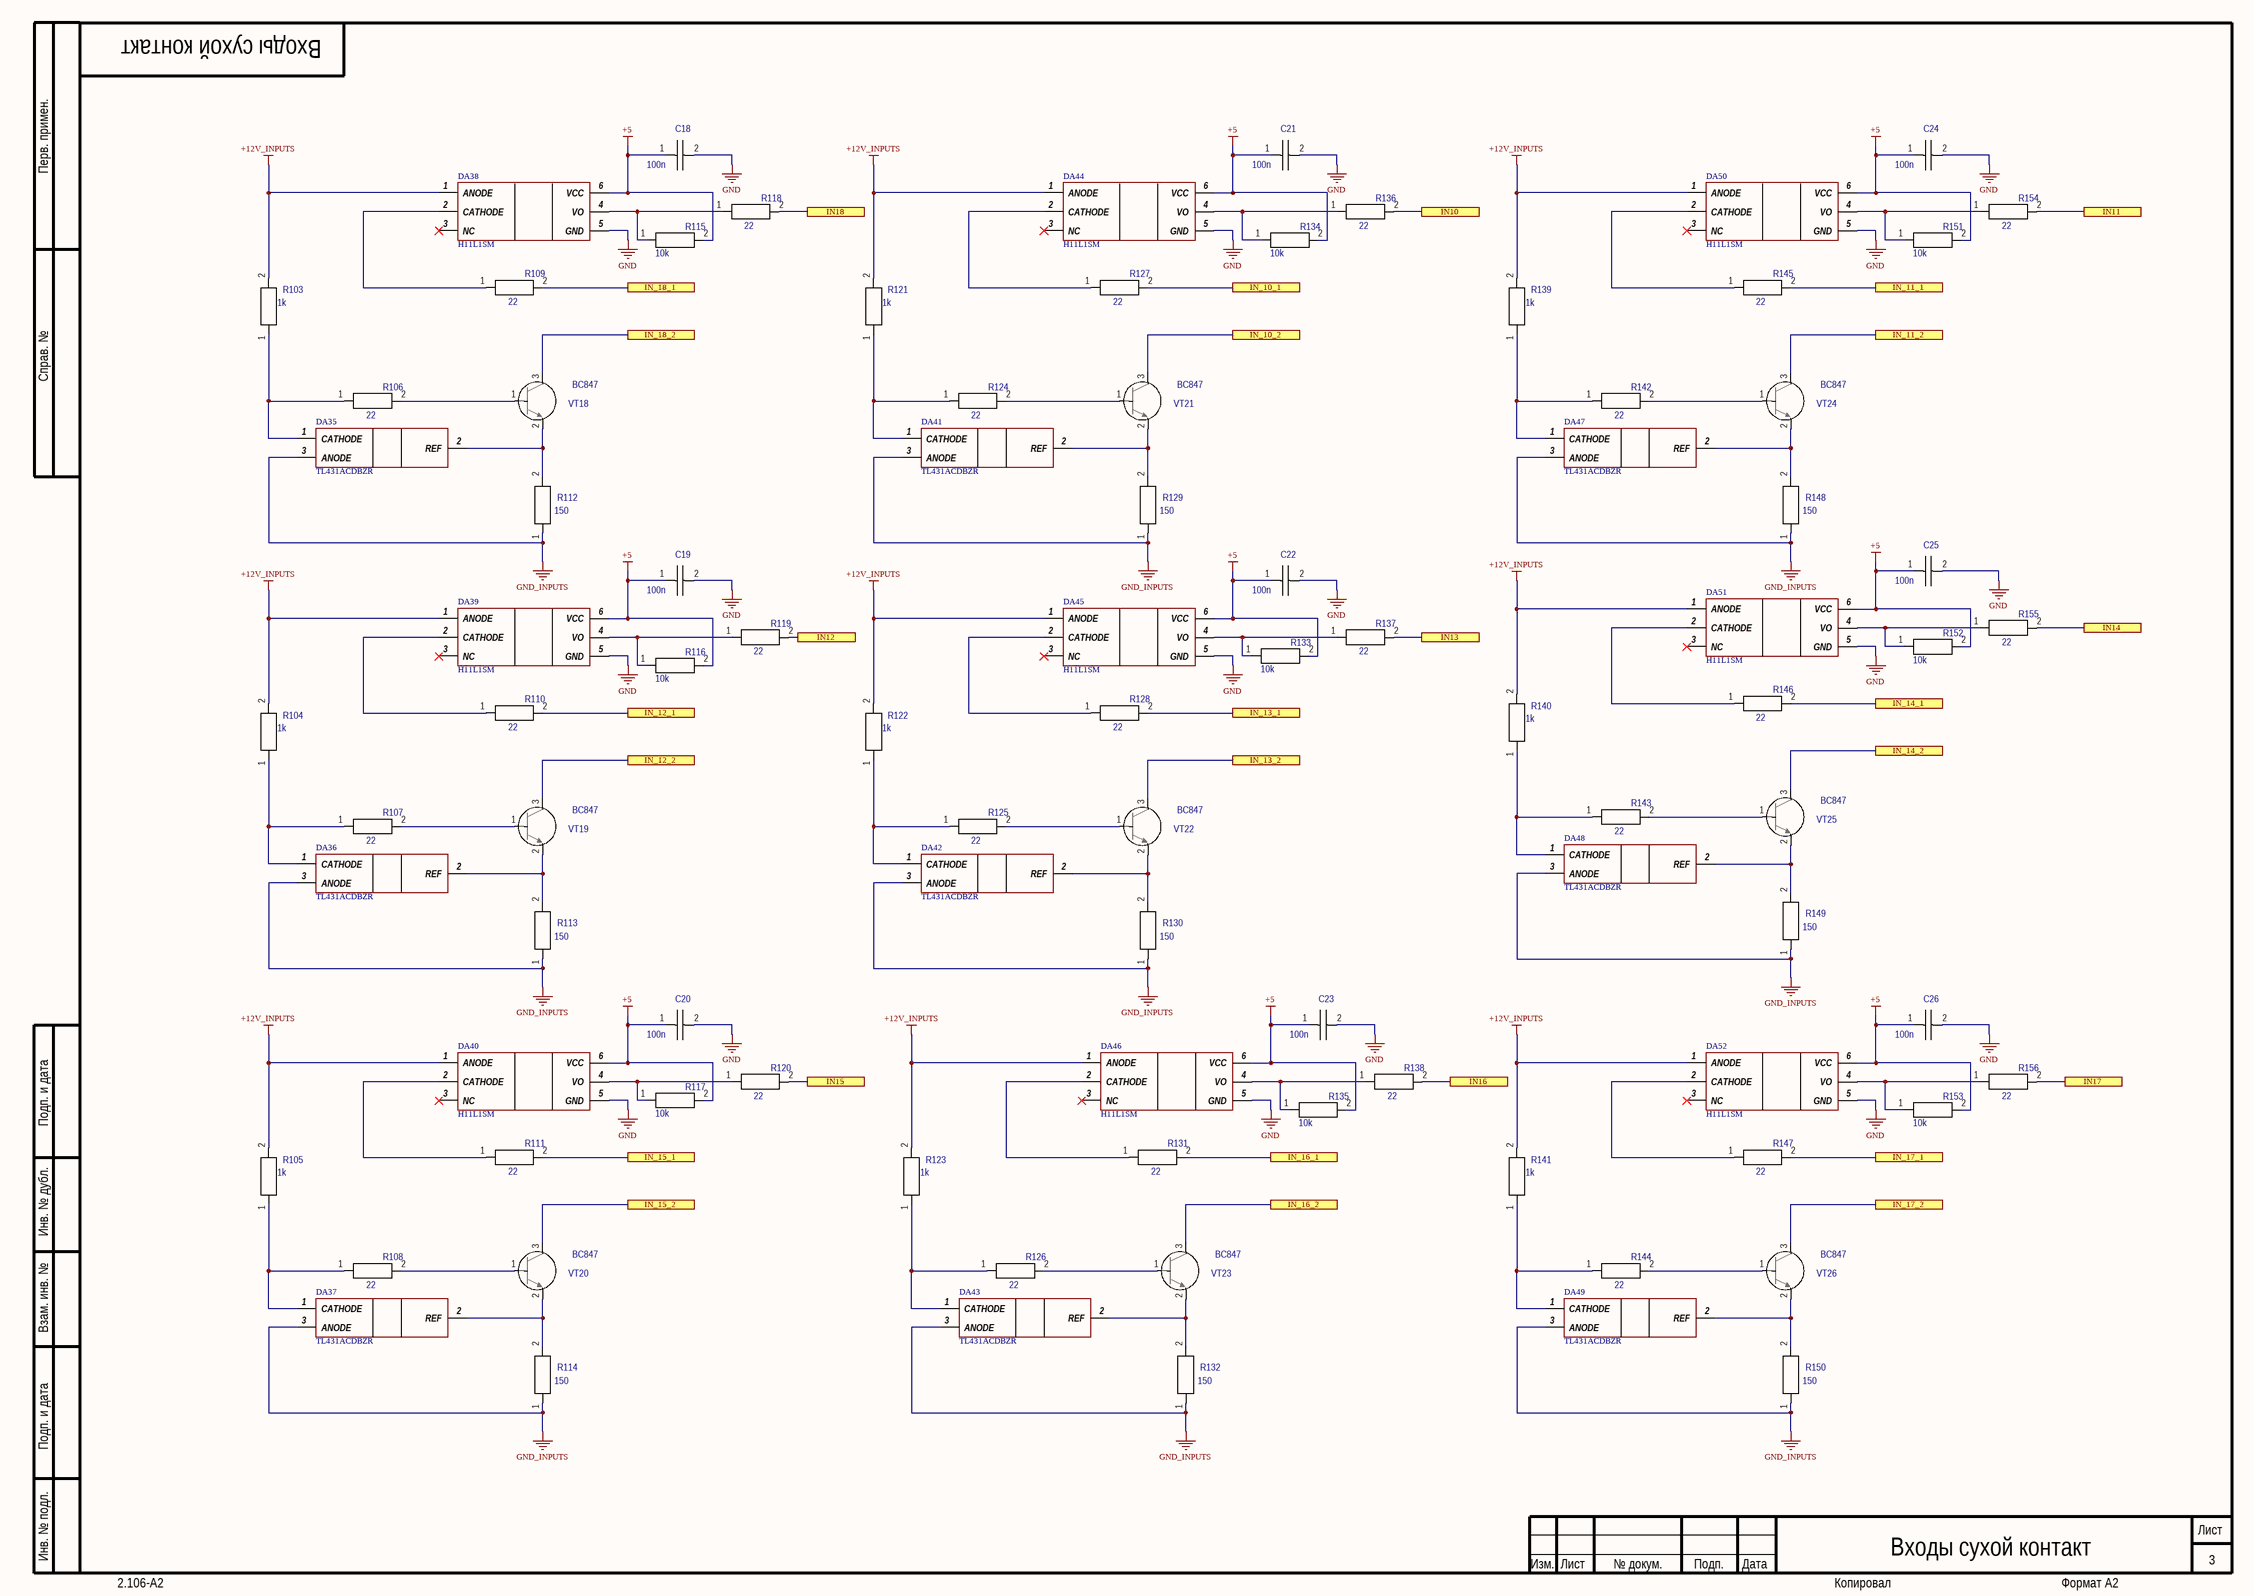
[diagram p5: 03_Inputs_10-18.SchDoc]

### Parts
C18  value 100n  [C0603]  (hidden comment: C0603)
C19  value 100n  [C0603]  (hidden comment: C0603)
C20  value 100n  [C0603]  (hidden comment: C0603)
C21  value 100n  [C0603]  (hidden comment: C0603)
C22  value 100n  [C0603]  (hidden comment: C0603)
C23  value 100n  [C0603]  (hidden comment: C0603)
C24  value 100n  [C0603]  (hidden comment: C0603)
C25  value 100n  [C0603]  (hidden comment: C0603)
C26  value 100n  [C0603]  (hidden comment: C0603)
DA35  TL431ACDBZR  [SOT95P237X112-3N]
DA36  TL431ACDBZR  [SOT95P237X112-3N]
DA37  TL431ACDBZR  [SOT95P237X112-3N]
DA38  H11L1SM  [SOP254P1030X460-6N]
DA39  H11L1SM  [SOP254P1030X460-6N]
DA40  H11L1SM  [SOP254P1030X460-6N]
DA41  TL431ACDBZR  [SOT95P237X112-3N]
DA42  TL431ACDBZR  [SOT95P237X112-3N]
DA43  TL431ACDBZR  [SOT95P237X112-3N]
DA44  H11L1SM  [SOP254P1030X460-6N]
DA45  H11L1SM  [SOP254P1030X460-6N]
DA46  H11L1SM  [SOP254P1030X460-6N]
DA47  TL431ACDBZR  [SOT95P237X112-3N]
DA48  TL431ACDBZR  [SOT95P237X112-3N]
DA49  TL431ACDBZR  [SOT95P237X112-3N]
DA50  H11L1SM  [SOP254P1030X460-6N]
DA51  H11L1SM  [SOP254P1030X460-6N]
DA52  H11L1SM  [SOP254P1030X460-6N]
R103  value 1k  [RESC1608N]  (hidden comment: R0603)
R104  value 1k  [RESC1608N]  (hidden comment: R0603)
R105  value 1k  [RESC1608N]  (hidden comment: R0603)
R106  value 22  [RESC1608N]  (hidden comment: R0603)
R107  value 22  [RESC1608N]  (hidden comment: R0603)
R108  value 22  [RESC1608N]  (hidden comment: R0603)
R109  value 22  [RESC1608N]  (hidden comment: R0603)
R110  value 22  [RESC1608N]  (hidden comment: R0603)
R111  value 22  [RESC1608N]  (hidden comment: R0603)
R112  value 150  [RESC1608N]  (hidden comment: R0603)
R113  value 150  [RESC1608N]  (hidden comment: R0603)
R114  value 150  [RESC1608N]  (hidden comment: R0603)
R115  value 10k  [RESC1608N]  (hidden comment: R0603)
R116  value 10k  [RESC1608N]  (hidden comment: R0603)
R117  value 10k  [RESC1608N]  (hidden comment: R0603)
R118  value 22  [RESC1608N]  (hidden comment: R0603)
R119  value 22  [RESC1608N]  (hidden comment: R0603)
R120  value 22  [RESC1608N]  (hidden comment: R0603)
R121  value 1k  [RESC1608N]  (hidden comment: R0603)
R122  value 1k  [RESC1608N]  (hidden comment: R0603)
R123  value 1k  [RESC1608N]  (hidden comment: R0603)
R124  value 22  [RESC1608N]  (hidden comment: R0603)
R125  value 22  [RESC1608N]  (hidden comment: R0603)
R126  value 22  [RESC1608N]  (hidden comment: R0603)
R127  value 22  [RESC1608N]  (hidden comment: R0603)
R128  value 22  [RESC1608N]  (hidden comment: R0603)
R129  value 150  [RESC1608N]  (hidden comment: R0603)
R130  value 150  [RESC1608N]  (hidden comment: R0603)
R131  value 22  [RESC1608N]  (hidden comment: R0603)
R132  value 150  [RESC1608N]  (hidden comment: R0603)
R133  value 10k  [RESC1608N]  (hidden comment: R0603)
R134  value 10k  [RESC1608N]  (hidden comment: R0603)
R135  value 10k  [RESC1608N]  (hidden comment: R0603)
R136  value 22  [RESC1608N]  (hidden comment: R0603)
R137  value 22  [RESC1608N]  (hidden comment: R0603)
R138  value 22  [RESC1608N]  (hidden comment: R0603)
R139  value 1k  [RESC1608N]  (hidden comment: R0603)
R140  value 1k  [RESC1608N]  (hidden comment: R0603)
R141  value 1k  [RESC1608N]  (hidden comment: R0603)
R142  value 22  [RESC1608N]  (hidden comment: R0603)
R143  value 22  [RESC1608N]  (hidden comment: R0603)
R144  value 22  [RESC1608N]  (hidden comment: R0603)
R145  value 22  [RESC1608N]  (hidden comment: R0603)
R146  value 22  [RESC1608N]  (hidden comment: R0603)
R147  value 22  [RESC1608N]  (hidden comment: R0603)
R148  value 150  [RESC1608N]  (hidden comment: R0603)
R149  value 150  [RESC1608N]  (hidden comment: R0603)
R150  value 150  [RESC1608N]  (hidden comment: R0603)
R151  value 10k  [RESC1608N]  (hidden comment: R0603)
R152  value 10k  [RESC1608N]  (hidden comment: R0603)
R153  value 10k  [RESC1608N]  (hidden comment: R0603)
R154  value 22  [RESC1608N]  (hidden comment: R0603)
R155  value 22  [RESC1608N]  (hidden comment: R0603)
R156  value 22  [RESC1608N]  (hidden comment: R0603)
VT18  BC847  [SOT23-3N]
VT19  BC847  [SOT23-3N]
VT20  BC847  [SOT23-3N]
VT21  BC847  [SOT23-3N]
VT22  BC847  [SOT23-3N]
VT23  BC847  [SOT23-3N]
VT24  BC847  [SOT23-3N]
VT25  BC847  [SOT23-3N]
VT26  BC847  [SOT23-3N]

### Ports
IN10, IN11, IN12, IN13, IN14, IN15, IN16, IN17, IN18, IN_10_1, IN_10_2, IN_11_1, IN_11_2, IN_12_1, IN_12_2, IN_13_1, IN_13_2, IN_14_1, IN_14_2, IN_15_1, IN_15_2, IN_16_1, IN_16_2, IN_17_1, IN_17_2, IN_18_1, IN_18_2

### Nets
+5: C18.1 C19.1 C20.1 C21.1 C22.1 C23.1 C24.1 C25.1 C26.1 DA38.6(VCC) DA39.6(VCC) DA40.6(VCC) DA44.6(VCC) DA45.6(VCC) DA46.6(VCC) DA50.6(VCC) DA51.6(VCC) DA52.6(VCC) R115.2 R116.2 R117.2 R133.2 R134.2 R135.2 R151.2 R152.2 R153.2
+12V_INPUTS: DA38.1(ANODE) DA39.1(ANODE) DA40.1(ANODE) DA44.1(ANODE) DA45.1(ANODE) DA46.1(ANODE) DA50.1(ANODE) DA51.1(ANODE) DA52.1(ANODE) R103.2 R104.2 R105.2 R121.2 R122.2 R123.2 R139.2 R140.2 R141.2
GND: C18.2 C19.2 C20.2 C21.2 C22.2 C23.2 C24.2 C25.2 C26.2 DA38.5(GND) DA39.5(GND) DA40.5(GND) DA44.5(GND) DA45.5(GND) DA46.5(GND) DA50.5(GND) DA51.5(GND) DA52.5(GND)
GND_INPUTS: DA35.3(ANODE) DA36.3(ANODE) DA37.3(ANODE) DA41.3(ANODE) DA42.3(ANODE) DA43.3(ANODE) DA47.3(ANODE) DA48.3(ANODE) DA49.3(ANODE) R112.1 R113.1 R114.1 R129.1 R130.1 R132.1 R148.1 R149.1 R150.1
19: R127.2 ; port IN_10_1
20: VT21.3 ; port IN_10_2
21: R145.2 ; port IN_11_1
22: VT24.3 ; port IN_11_2
23: R110.2 ; port IN_12_1
24: VT19.3 ; port IN_12_2
25: R128.2 ; port IN_13_1
26: VT22.3 ; port IN_13_2
27: R146.2 ; port IN_14_1
28: VT25.3 ; port IN_14_2
29: R111.2 ; port IN_15_1
30: VT20.3 ; port IN_15_2
31: R131.2 ; port IN_16_1
32: VT23.3 ; port IN_16_2
33: R147.2 ; port IN_17_1
34: VT26.3 ; port IN_17_2
35: R109.2 ; port IN_18_1
36: VT18.3 ; port IN_18_2
NetDA35_1: DA35.1(CATHODE) R103.1 R106.1
NetDA35_2: DA35.2(REF) R112.2 VT18.2
NetDA36_1: DA36.1(CATHODE) R104.1 R107.1
NetDA36_2: DA36.2(REF) R113.2 VT19.2
NetDA37_1: DA37.1(CATHODE) R105.1 R108.1
NetDA37_2: DA37.2(REF) R114.2 VT20.2
NetDA38_2: DA38.2(CATHODE) R109.1
NetDA38_4: DA38.4(VO) R115.1 R118.1
NetDA39_2: DA39.2(CATHODE) R110.1
NetDA39_4: DA39.4(VO) R116.1 R119.1
NetDA40_2: DA40.2(CATHODE) R111.1
NetDA40_4: DA40.4(VO) R117.1 R120.1
NetDA41_1: DA41.1(CATHODE) R121.1 R124.1
NetDA41_2: DA41.2(REF) R129.2 VT21.2
NetDA42_1: DA42.1(CATHODE) R122.1 R125.1
NetDA42_2: DA42.2(REF) R130.2 VT22.2
NetDA43_1: DA43.1(CATHODE) R123.1 R126.1
NetDA43_2: DA43.2(REF) R132.2 VT23.2
NetDA44_2: DA44.2(CATHODE) R127.1
NetDA44_4: DA44.4(VO) R134.1 R136.1
NetDA45_2: DA45.2(CATHODE) R128.1
NetDA45_4: DA45.4(VO) R133.1 R137.1
NetDA46_2: DA46.2(CATHODE) R131.1
NetDA46_4: DA46.4(VO) R135.1 R138.1
NetDA47_1: DA47.1(CATHODE) R139.1 R142.1
NetDA47_2: DA47.2(REF) R148.2 VT24.2
NetDA48_1: DA48.1(CATHODE) R140.1 R143.1
NetDA48_2: DA48.2(REF) R149.2 VT25.2
NetDA49_1: DA49.1(CATHODE) R141.1 R144.1
NetDA49_2: DA49.2(REF) R150.2 VT26.2
NetDA50_2: DA50.2(CATHODE) R145.1
NetDA50_4: DA50.4(VO) R151.1 R154.1
NetDA51_2: DA51.2(CATHODE) R146.1
NetDA51_4: DA51.4(VO) R152.1 R155.1
NetDA52_2: DA52.2(CATHODE) R147.1
NetDA52_4: DA52.4(VO) R153.1 R156.1
NetR106_2: R106.2 VT18.1
NetR107_2: R107.2 VT19.1
NetR108_2: R108.2 VT20.1
NetR118_2: R118.2 ; port IN18
NetR119_2: R119.2 ; port IN12
NetR120_2: R120.2 ; port IN15
NetR124_2: R124.2 VT21.1
NetR125_2: R125.2 VT22.1
NetR126_2: R126.2 VT23.1
NetR136_2: R136.2 ; port IN10
NetR137_2: R137.2 ; port IN13
NetR138_2: R138.2 ; port IN16
NetR142_2: R142.2 VT24.1
NetR143_2: R143.2 VT25.1
NetR144_2: R144.2 VT26.1
NetR154_2: R154.2 ; port IN11
NetR155_2: R155.2 ; port IN14
NetR156_2: R156.2 ; port IN17

Not connected (* = marked no-connect by the designer): DA38 3(NC)*; DA39 3(NC)*; DA40 3(NC)*; DA44 3(NC)*; DA45 3(NC)*; DA46 3(NC)*; DA50 3(NC)*; DA51 3(NC)*; DA52 3(NC)*

### Notes on the sheet
- Перв. примен.
- Справ. №
- Подп. и дата
- Инв. № дубл.
- Взам. инв. №
- Инв. № подл.
- Изм.
- Лист
- № докум.
- Подп.
- Дата
- 2.106-A2
- Копировал
- Формат А2

### Library data of the parts
C18-C26 = GRM188R71C104KA01D: as C9 on sheet 02_Inputs_1-9; Comments: C0603; Part Number: GRM188R71C104KA01D; Height: 0.9; Package: C0603; TemperatureMin: -55; TemperatureMax: 125
DA35-DA37 DA41-DA43 DA47-DA49 = TL431ACDBZR: as DA17 on sheet 02_Inputs_1-9; Datasheet Link: https://datasheet.datasheetarchive.com/originals/distributors/SFDatasheet-6/sf-000131849.pdf; Manufacturer_Part_Number: TL431ACDBZR; Mouser Part Number: 595-TL431ACDBZR; Mouser Price/Stock: https://www.mouser.co.uk/ProductDetail/Texas-Instruments/TL431ACDBZR?qs=odmYgEirbwzMcBuFx%2Fo8hQ%3D%3D; Arrow Part Number: TL431ACDBZR; Arrow Price/Stock: https://www.arrow.com/en/products/tl431acdbzr/texas-instruments?region=nac; PartNumber: TL431ACDBZR
DA38-DA40 DA44-DA46 DA50-DA52 = H11L1SM: as DA20 on sheet 02_Inputs_1-9; Datasheet Link: http://isocom.com/wp-content/uploads/2017/09/DD93224-H11L1_H11L1V-110817.pdf; Height: 4.6mm; Manufacturer_Part_Number: H11L1SM; PartNumber: H11L1SM
R103-R105 R121-R123 R139-R141 = RC0603FK-071KL: as R49 on sheet 02_Inputs_1-9; Comments: R0603; Part Number: RC0603FK-071KL; Package: R0603; TemperatureMin: -55; TemperatureMax: 155
R106-R111 R118-R120 R124-R128 R131 R136-R138 R142-R147 R154-R156 = RC0603FK-0722RL: as R52 on sheet 02_Inputs_1-9; Comments: R0603; Part Number: RC0603FK-0722RL; Package: R0603; TemperatureMin: -55; TemperatureMax: 155
R112-R114 R129 R130 R132 R148-R150 = RC0603FK-07150RL: as R58 on sheet 02_Inputs_1-9; Comments: R0603; Part Number: RC0603FK-07150RL; Package: R0603; TemperatureMin: -55; TemperatureMax: 155
R115-R117 R133-R135 R151-R153 = RC0603FK-0710KL: as R61 on sheet 02_Inputs_1-9; Comments: R0603; Package: R0603; TemperatureMin: -55; TemperatureMax: 155
VT18-VT26 = BC847: as VT9 on sheet 02_Inputs_1-9; Com: BC847; Part Number: BC847; Package: sot23

## Sheet 04_Inputs_19-27.SchDoc
size 594 x 420 mm; DocumentNumber: Входы сухой контакт; SheetNumber: 4; SheetTotal: 6
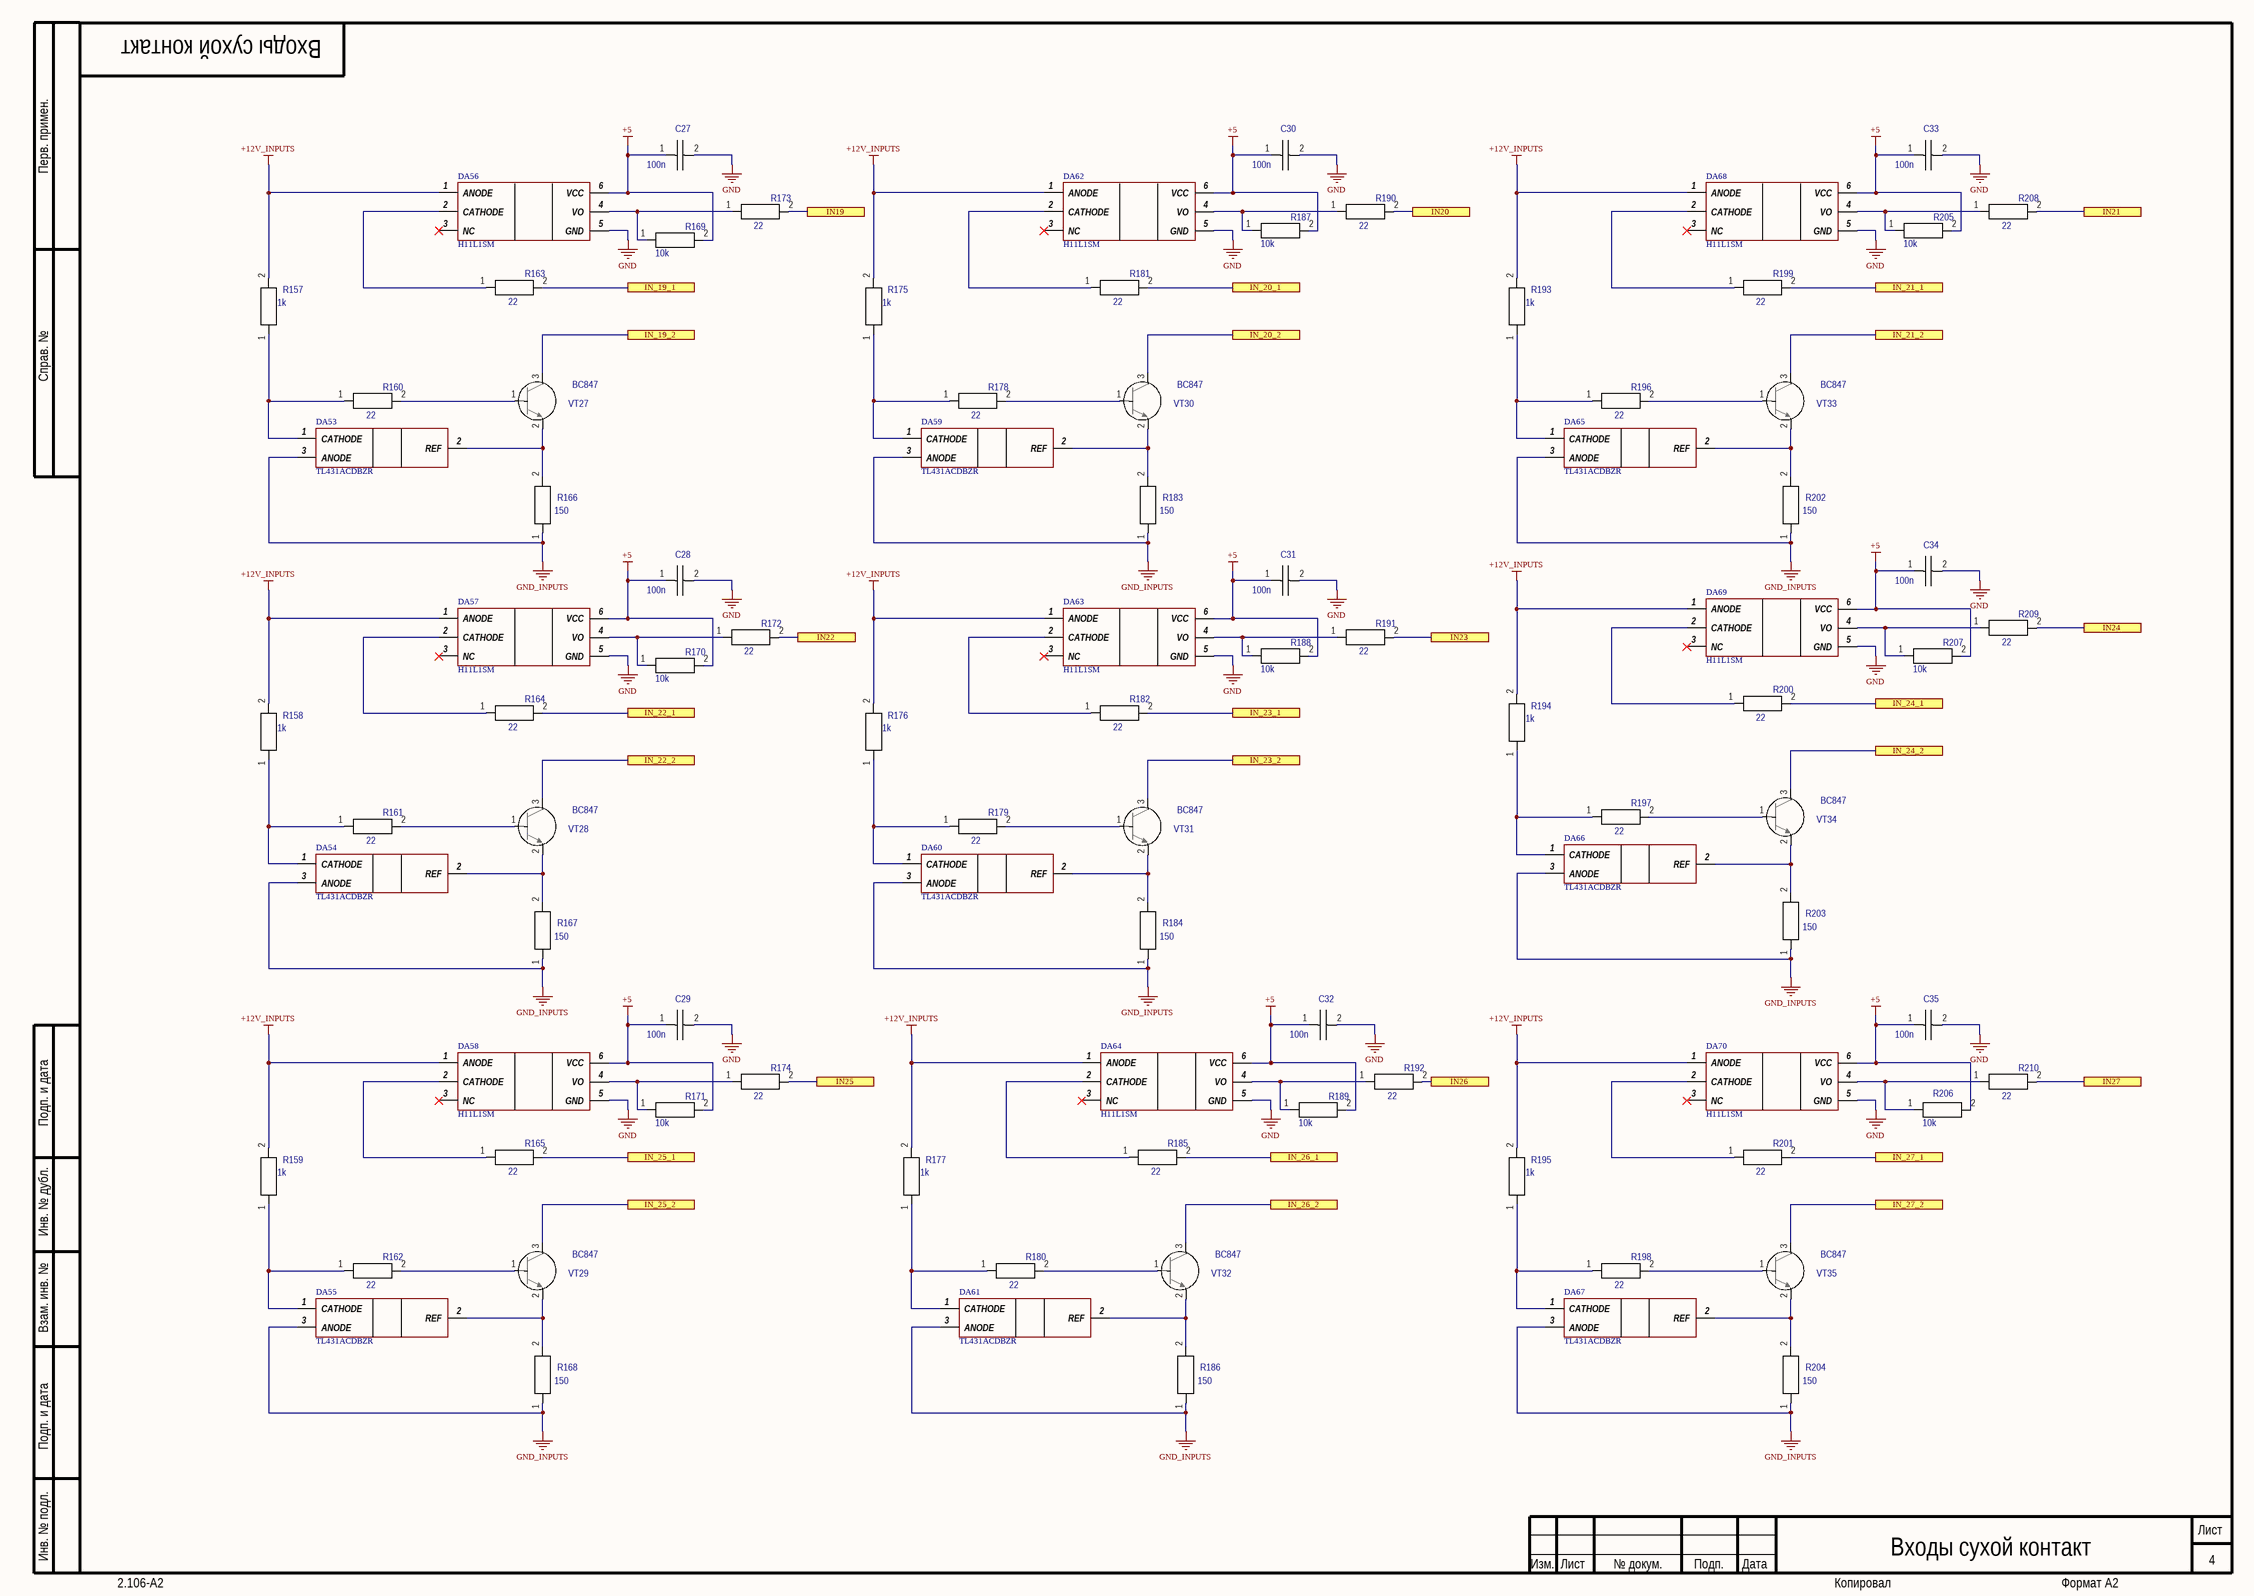
[diagram p6: 04_Inputs_19-27.SchDoc]

### Parts
C27  value 100n  [C0603]  (hidden comment: C0603)
C28  value 100n  [C0603]  (hidden comment: C0603)
C29  value 100n  [C0603]  (hidden comment: C0603)
C30  value 100n  [C0603]  (hidden comment: C0603)
C31  value 100n  [C0603]  (hidden comment: C0603)
C32  value 100n  [C0603]  (hidden comment: C0603)
C33  value 100n  [C0603]  (hidden comment: C0603)
C34  value 100n  [C0603]  (hidden comment: C0603)
C35  value 100n  [C0603]  (hidden comment: C0603)
DA53  TL431ACDBZR  [SOT95P237X112-3N]
DA54  TL431ACDBZR  [SOT95P237X112-3N]
DA55  TL431ACDBZR  [SOT95P237X112-3N]
DA56  H11L1SM  [SOP254P1030X460-6N]
DA57  H11L1SM  [SOP254P1030X460-6N]
DA58  H11L1SM  [SOP254P1030X460-6N]
DA59  TL431ACDBZR  [SOT95P237X112-3N]
DA60  TL431ACDBZR  [SOT95P237X112-3N]
DA61  TL431ACDBZR  [SOT95P237X112-3N]
DA62  H11L1SM  [SOP254P1030X460-6N]
DA63  H11L1SM  [SOP254P1030X460-6N]
DA64  H11L1SM  [SOP254P1030X460-6N]
DA65  TL431ACDBZR  [SOT95P237X112-3N]
DA66  TL431ACDBZR  [SOT95P237X112-3N]
DA67  TL431ACDBZR  [SOT95P237X112-3N]
DA68  H11L1SM  [SOP254P1030X460-6N]
DA69  H11L1SM  [SOP254P1030X460-6N]
DA70  H11L1SM  [SOP254P1030X460-6N]
R157  value 1k  [RESC1608N]  (hidden comment: R0603)
R158  value 1k  [RESC1608N]  (hidden comment: R0603)
R159  value 1k  [RESC1608N]  (hidden comment: R0603)
R160  value 22  [RESC1608N]  (hidden comment: R0603)
R161  value 22  [RESC1608N]  (hidden comment: R0603)
R162  value 22  [RESC1608N]  (hidden comment: R0603)
R163  value 22  [RESC1608N]  (hidden comment: R0603)
R164  value 22  [RESC1608N]  (hidden comment: R0603)
R165  value 22  [RESC1608N]  (hidden comment: R0603)
R166  value 150  [RESC1608N]  (hidden comment: R0603)
R167  value 150  [RESC1608N]  (hidden comment: R0603)
R168  value 150  [RESC1608N]  (hidden comment: R0603)
R169  value 10k  [RESC1608N]  (hidden comment: R0603)
R170  value 10k  [RESC1608N]  (hidden comment: R0603)
R171  value 10k  [RESC1608N]  (hidden comment: R0603)
R172  value 22  [RESC1608N]  (hidden comment: R0603)
R173  value 22  [RESC1608N]  (hidden comment: R0603)
R174  value 22  [RESC1608N]  (hidden comment: R0603)
R175  value 1k  [RESC1608N]  (hidden comment: R0603)
R176  value 1k  [RESC1608N]  (hidden comment: R0603)
R177  value 1k  [RESC1608N]  (hidden comment: R0603)
R178  value 22  [RESC1608N]  (hidden comment: R0603)
R179  value 22  [RESC1608N]  (hidden comment: R0603)
R180  value 22  [RESC1608N]  (hidden comment: R0603)
R181  value 22  [RESC1608N]  (hidden comment: R0603)
R182  value 22  [RESC1608N]  (hidden comment: R0603)
R183  value 150  [RESC1608N]  (hidden comment: R0603)
R184  value 150  [RESC1608N]  (hidden comment: R0603)
R185  value 22  [RESC1608N]  (hidden comment: R0603)
R186  value 150  [RESC1608N]  (hidden comment: R0603)
R187  value 10k  [RESC1608N]  (hidden comment: R0603)
R188  value 10k  [RESC1608N]  (hidden comment: R0603)
R189  value 10k  [RESC1608N]  (hidden comment: R0603)
R190  value 22  [RESC1608N]  (hidden comment: R0603)
R191  value 22  [RESC1608N]  (hidden comment: R0603)
R192  value 22  [RESC1608N]  (hidden comment: R0603)
R193  value 1k  [RESC1608N]  (hidden comment: R0603)
R194  value 1k  [RESC1608N]  (hidden comment: R0603)
R195  value 1k  [RESC1608N]  (hidden comment: R0603)
R196  value 22  [RESC1608N]  (hidden comment: R0603)
R197  value 22  [RESC1608N]  (hidden comment: R0603)
R198  value 22  [RESC1608N]  (hidden comment: R0603)
R199  value 22  [RESC1608N]  (hidden comment: R0603)
R200  value 22  [RESC1608N]  (hidden comment: R0603)
R201  value 22  [RESC1608N]  (hidden comment: R0603)
R202  value 150  [RESC1608N]  (hidden comment: R0603)
R203  value 150  [RESC1608N]  (hidden comment: R0603)
R204  value 150  [RESC1608N]  (hidden comment: R0603)
R205  value 10k  [RESC1608N]  (hidden comment: R0603)
R206  value 10k  [RESC1608N]  (hidden comment: R0603)
R207  value 10k  [RESC1608N]  (hidden comment: R0603)
R208  value 22  [RESC1608N]  (hidden comment: R0603)
R209  value 22  [RESC1608N]  (hidden comment: R0603)
R210  value 22  [RESC1608N]  (hidden comment: R0603)
VT27  BC847  [SOT23-3N]
VT28  BC847  [SOT23-3N]
VT29  BC847  [SOT23-3N]
VT30  BC847  [SOT23-3N]
VT31  BC847  [SOT23-3N]
VT32  BC847  [SOT23-3N]
VT33  BC847  [SOT23-3N]
VT34  BC847  [SOT23-3N]
VT35  BC847  [SOT23-3N]

### Ports
IN19, IN20, IN21, IN22, IN23, IN24, IN25, IN26, IN27, IN_19_1, IN_19_2, IN_20_1, IN_20_2, IN_21_1, IN_21_2, IN_22_1, IN_22_2, IN_23_1, IN_23_2, IN_24_1, IN_24_2, IN_25_1, IN_25_2, IN_26_1, IN_26_2, IN_27_1, IN_27_2

### Nets
+5: C27.1 C28.1 C29.1 C30.1 C31.1 C32.1 C33.1 C34.1 C35.1 DA56.6(VCC) DA57.6(VCC) DA58.6(VCC) DA62.6(VCC) DA63.6(VCC) DA64.6(VCC) DA68.6(VCC) DA69.6(VCC) DA70.6(VCC) R169.2 R170.2 R171.2 R187.2 R188.2 R189.2 R205.2 R206.2 R207.2
+12V_INPUTS: DA56.1(ANODE) DA57.1(ANODE) DA58.1(ANODE) DA62.1(ANODE) DA63.1(ANODE) DA64.1(ANODE) DA68.1(ANODE) DA69.1(ANODE) DA70.1(ANODE) R157.2 R158.2 R159.2 R175.2 R176.2 R177.2 R193.2 R194.2 R195.2
GND: C27.2 C28.2 C29.2 C30.2 C31.2 C32.2 C33.2 C34.2 C35.2 DA56.5(GND) DA57.5(GND) DA58.5(GND) DA62.5(GND) DA63.5(GND) DA64.5(GND) DA68.5(GND) DA69.5(GND) DA70.5(GND)
GND_INPUTS: DA53.3(ANODE) DA54.3(ANODE) DA55.3(ANODE) DA59.3(ANODE) DA60.3(ANODE) DA61.3(ANODE) DA65.3(ANODE) DA66.3(ANODE) DA67.3(ANODE) R166.1 R167.1 R168.1 R183.1 R184.1 R186.1 R202.1 R203.1 R204.1
37: R163.2 ; port IN_19_1
38: VT27.3 ; port IN_19_2
39: R181.2 ; port IN_20_1
40: VT30.3 ; port IN_20_2
41: R199.2 ; port IN_21_1
42: VT33.3 ; port IN_21_2
43: R164.2 ; port IN_22_1
44: VT28.3 ; port IN_22_2
45: R182.2 ; port IN_23_1
46: VT31.3 ; port IN_23_2
47: R200.2 ; port IN_24_1
48: VT34.3 ; port IN_24_2
49: R165.2 ; port IN_25_1
50: VT29.3 ; port IN_25_2
51: R185.2 ; port IN_26_1
52: VT32.3 ; port IN_26_2
53: R201.2 ; port IN_27_1
54: VT35.3 ; port IN_27_2
NetDA53_1: DA53.1(CATHODE) R157.1 R160.1
NetDA53_2: DA53.2(REF) R166.2 VT27.2
NetDA54_1: DA54.1(CATHODE) R158.1 R161.1
NetDA54_2: DA54.2(REF) R167.2 VT28.2
NetDA55_1: DA55.1(CATHODE) R159.1 R162.1
NetDA55_2: DA55.2(REF) R168.2 VT29.2
NetDA56_2: DA56.2(CATHODE) R163.1
NetDA56_4: DA56.4(VO) R169.1 R173.1
NetDA57_2: DA57.2(CATHODE) R164.1
NetDA57_4: DA57.4(VO) R170.1 R172.1
NetDA58_2: DA58.2(CATHODE) R165.1
NetDA58_4: DA58.4(VO) R171.1 R174.1
NetDA59_1: DA59.1(CATHODE) R175.1 R178.1
NetDA59_2: DA59.2(REF) R183.2 VT30.2
NetDA60_1: DA60.1(CATHODE) R176.1 R179.1
NetDA60_2: DA60.2(REF) R184.2 VT31.2
NetDA61_1: DA61.1(CATHODE) R177.1 R180.1
NetDA61_2: DA61.2(REF) R186.2 VT32.2
NetDA62_2: DA62.2(CATHODE) R181.1
NetDA62_4: DA62.4(VO) R187.1 R190.1
NetDA63_2: DA63.2(CATHODE) R182.1
NetDA63_4: DA63.4(VO) R188.1 R191.1
NetDA64_2: DA64.2(CATHODE) R185.1
NetDA64_4: DA64.4(VO) R189.1 R192.1
NetDA65_1: DA65.1(CATHODE) R193.1 R196.1
NetDA65_2: DA65.2(REF) R202.2 VT33.2
NetDA66_1: DA66.1(CATHODE) R194.1 R197.1
NetDA66_2: DA66.2(REF) R203.2 VT34.2
NetDA67_1: DA67.1(CATHODE) R195.1 R198.1
NetDA67_2: DA67.2(REF) R204.2 VT35.2
NetDA68_2: DA68.2(CATHODE) R199.1
NetDA68_4: DA68.4(VO) R205.1 R208.1
NetDA69_2: DA69.2(CATHODE) R200.1
NetDA69_4: DA69.4(VO) R207.1 R209.1
NetDA70_2: DA70.2(CATHODE) R201.1
NetDA70_4: DA70.4(VO) R206.1 R210.1
NetR160_2: R160.2 VT27.1
NetR161_2: R161.2 VT28.1
NetR162_2: R162.2 VT29.1
NetR172_2: R172.2 ; port IN22
NetR173_2: R173.2 ; port IN19
NetR174_2: R174.2 ; port IN25
NetR178_2: R178.2 VT30.1
NetR179_2: R179.2 VT31.1
NetR180_2: R180.2 VT32.1
NetR190_2: R190.2 ; port IN20
NetR191_2: R191.2 ; port IN23
NetR192_2: R192.2 ; port IN26
NetR196_2: R196.2 VT33.1
NetR197_2: R197.2 VT34.1
NetR198_2: R198.2 VT35.1
NetR208_2: R208.2 ; port IN21
NetR209_2: R209.2 ; port IN24
NetR210_2: R210.2 ; port IN27

Not connected (* = marked no-connect by the designer): DA56 3(NC)*; DA57 3(NC)*; DA58 3(NC)*; DA62 3(NC)*; DA63 3(NC)*; DA64 3(NC)*; DA68 3(NC)*; DA69 3(NC)*; DA70 3(NC)*

### Notes on the sheet
- Перв. примен.
- Справ. №
- Подп. и дата
- Инв. № дубл.
- Взам. инв. №
- Инв. № подл.
- Изм.
- Лист
- № докум.
- Подп.
- Дата
- 2.106-A2
- Копировал
- Формат А2

### Library data of the parts
C27-C35 = GRM188R71C104KA01D: as C9 on sheet 02_Inputs_1-9; Comments: C0603; Part Number: GRM188R71C104KA01D; Height: 0.9; Package: C0603; TemperatureMin: -55; TemperatureMax: 125
DA53-DA55 DA59-DA61 DA65-DA67 = TL431ACDBZR: as DA17 on sheet 02_Inputs_1-9; Datasheet Link: https://datasheet.datasheetarchive.com/originals/distributors/SFDatasheet-6/sf-000131849.pdf; Manufacturer_Part_Number: TL431ACDBZR; Mouser Part Number: 595-TL431ACDBZR; Mouser Price/Stock: https://www.mouser.co.uk/ProductDetail/Texas-Instruments/TL431ACDBZR?qs=odmYgEirbwzMcBuFx%2Fo8hQ%3D%3D; Arrow Part Number: TL431ACDBZR; Arrow Price/Stock: https://www.arrow.com/en/products/tl431acdbzr/texas-instruments?region=nac; PartNumber: TL431ACDBZR
DA56-DA58 DA62-DA64 DA68-DA70 = H11L1SM: as DA20 on sheet 02_Inputs_1-9; Datasheet Link: http://isocom.com/wp-content/uploads/2017/09/DD93224-H11L1_H11L1V-110817.pdf; Height: 4.6mm; Manufacturer_Part_Number: H11L1SM; PartNumber: H11L1SM
R157-R159 R175-R177 R193-R195 = RC0603FK-071KL: as R49 on sheet 02_Inputs_1-9; Comments: R0603; Part Number: RC0603FK-071KL; Package: R0603; TemperatureMin: -55; TemperatureMax: 155
R160-R165 R172-R174 R178-R182 R185 R190-R192 R196-R201 R208-R210 = RC0603FK-0722RL: as R52 on sheet 02_Inputs_1-9; Comments: R0603; Part Number: RC0603FK-0722RL; Package: R0603; TemperatureMin: -55; TemperatureMax: 155
R166-R168 R183 R184 R186 R202-R204 = RC0603FK-07150RL: as R58 on sheet 02_Inputs_1-9; Comments: R0603; Part Number: RC0603FK-07150RL; Package: R0603; TemperatureMin: -55; TemperatureMax: 155
R169-R171 R187-R189 R205-R207 = RC0603FK-0710KL: as R61 on sheet 02_Inputs_1-9; Comments: R0603; Package: R0603; TemperatureMin: -55; TemperatureMax: 155
VT27-VT35 = BC847: as VT9 on sheet 02_Inputs_1-9; Com: BC847; Part Number: BC847; Package: sot23